# Altium project Shaeen.PrjPcb (part 1 of 2)
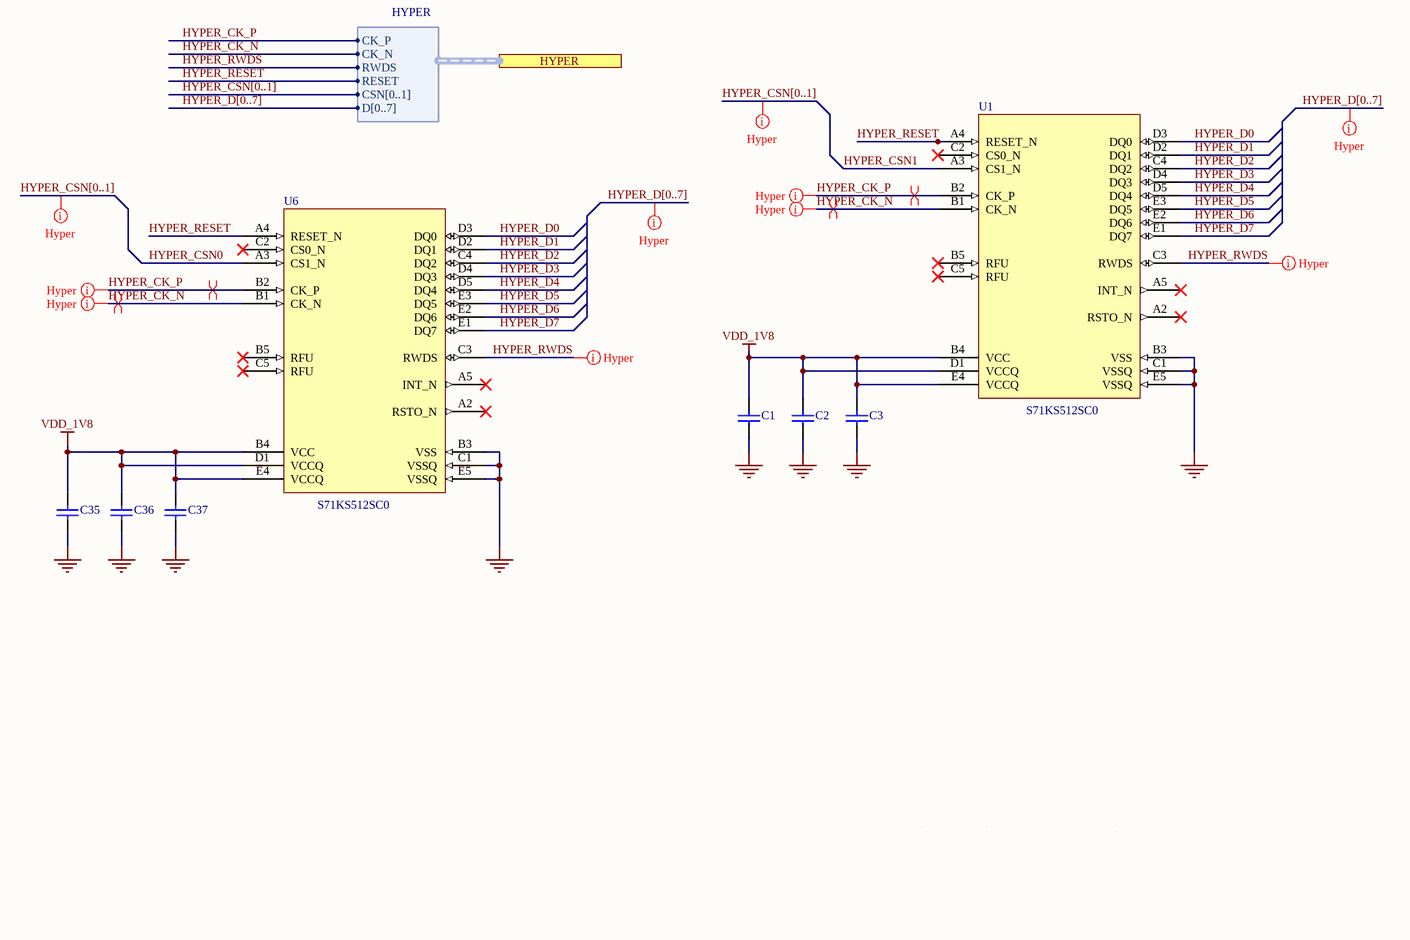
[diagram p0: HyperRAM.SchDoc]
6 sheets, 163 parts. Net scope: flat (ports and power ports of the same name join across sheets).
Board file: Shaheen.PcbDoc
Sheets:
  HyperRAM.SchDoc
  HyperRAM2.SchDoc
  Nordic.SchDoc
  PowerDomain.SchDoc
  Shaheen.SchDoc
  Switches.SchDoc

## Sheet HyperRAM.SchDoc: Shaheen PCB Board
size A3; Author: Mattia Sinigaglia; CompanyName: University of Bologna; DrawnBy: Mattia Sinigaglia; Organization: EES - Micrel Lab; Revision: v1; SheetNumber: 1; SheetTotal: 6

### Parts
C1  VJ0603Y104KNXAO  [CAPC1608X92X38LL15T08]  (value not drawn)
C2  VJ0603Y104KNXAO  [CAPC1608X92X38LL15T08]  (value not drawn)
C3  VJ0603Y104KNXAO  [CAPC1608X92X38LL15T08]  (value not drawn)
C35  VJ0603Y104KNXAO  [CAPC1608X92X38LL15T08]  (value not drawn)
C36  VJ0603Y104KNXAO  [CAPC1608X92X38LL15T08]  (value not drawn)
C37  VJ0603Y104KNXAO  [CAPC1608X92X38LL15T08]  (value not drawn)
U1  S71KS512SC0  [FBGA24_A-130]
U6  S71KS512SC0  [FBGA24_A-130]

### Ports
HYPER (harness HYPER)

### Harnesses
HYPER: CK_N, CK_P, RWDS, CSN[0..1], D[0..7], RESET

### Nets
GND: C1.1 C2.1 C3.1 C35.1 C36.1 C37.1 U1.B3(VSS) U1.C1(VSSQ) U1.E5(VSSQ) U6.B3(VSS) U6.C1(VSSQ) U6.E5(VSSQ)
VDD_1V8: C1.2 C2.2 C3.2 C35.2 C36.2 C37.2 U1.B4(VCC) U1.D1(VCCQ) U1.E4(VCCQ) U6.B4(VCC) U6.D1(VCCQ) U6.E4(VCCQ)
HYPER_CK_N: U1.B1(CK_N) U6.B1(CK_N) ; port HYPER.CK_N
HYPER_CK_P: U1.B2(CK_P) U6.B2(CK_P) ; port HYPER.CK_P
HYPER_CSN0: U6.A3(CS1_N)
HYPER_CSN1: U1.A3(CS1_N)
HYPER_D0: U1.D3(DQ0) U6.D3(DQ0)
HYPER_D1: U1.D2(DQ1) U6.D2(DQ1)
HYPER_D2: U1.C4(DQ2) U6.C4(DQ2)
HYPER_D3: U1.D4(DQ3) U6.D4(DQ3)
HYPER_D4: U1.D5(DQ4) U6.D5(DQ4)
HYPER_D5: U1.E3(DQ5) U6.E3(DQ5)
HYPER_D6: U1.E2(DQ6) U6.E2(DQ6)
HYPER_D7: U1.E1(DQ7) U6.E1(DQ7)
HYPER_RESET: U1.A4(RESET_N) U6.A4(RESET_N) ; port HYPER.RESET
HYPER_RWDS: U1.C3(RWDS) U6.C3(RWDS) ; port HYPER.RWDS

Not connected (* = marked no-connect by the designer): U1 A2(RSTO_N)* A5(INT_N)* B5(RFU)* C2(CS0_N)* C5(RFU)*; U6 A2(RSTO_N)* A5(INT_N)* B5(RFU)* C2(CS0_N)* C5(RFU)*

### Buses and harness runs
bus HYPER_CSN[0..1]
bus HYPER_D[0..7]

### Layout directives
net class Hyper: (no net found under the mark), HYPER_CK_N, HYPER_CK_P, HYPER_RWDS
differential pair: HYPER_CK_N, HYPER_CK_P

### Notes on the sheet
- 1
- 2
- 3
- 4
- 5
- 6
- 7
- 8
- A
- B
- C
- D
- Project:
- Date:
- Drawing number:
- Rev:
- Format:
- A3
- Drawn by:
- Laboratory:
- Page
- Sheet:
- of
- File:

### Library data of the parts
C1-C3 C35-C37 = CMP-1035-02588-2: Manufacturer: Vitramon; Part Number: VJ0603Y104KNXAO

## Sheet HyperRAM2.SchDoc: Shaheen PCB Board
size A3; Author: Mattia Sinigaglia; CompanyName: University of Bologna; DrawnBy: Mattia Sinigaglia; Organization: EES - Micrel Lab; Revision: v1; SheetNumber: 2; SheetTotal: 6
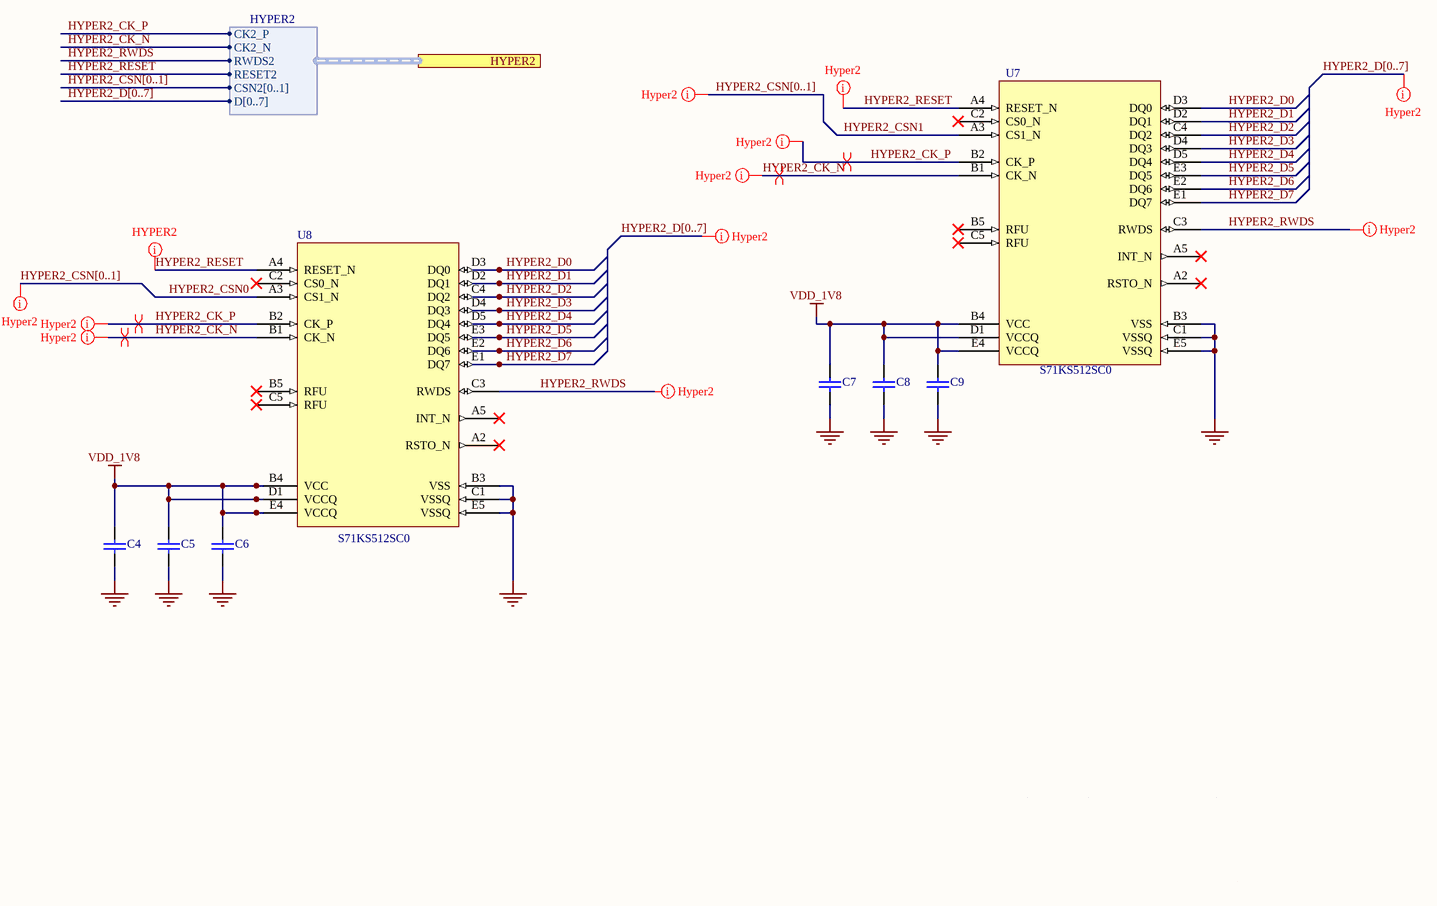
[diagram p1: HyperRAM2.SchDoc]

### Parts
C4  VJ0603Y104KNXAO  [CAPC1608X92X38LL15T08]  (value not drawn)
C5  VJ0603Y104KNXAO  [CAPC1608X92X38LL15T08]  (value not drawn)
C6  VJ0603Y104KNXAO  [CAPC1608X92X38LL15T08]  (value not drawn)
C7  VJ0603Y104KNXAO  [CAPC1608X92X38LL15T08]  (value not drawn)
C8  VJ0603Y104KNXAO  [CAPC1608X92X38LL15T08]  (value not drawn)
C9  VJ0603Y104KNXAO  [CAPC1608X92X38LL15T08]  (value not drawn)
U7  S71KS512SC0  [FBGA24_A-130]
U8  S71KS512SC0  [FBGA24_A-130]

### Ports
HYPER2 (harness HYPER2)

### Harnesses
HYPER2: D[0..7], CK2_P, CK2_N, RWDS2, CSN2[0..1], RESET2

### Nets
GND: C4.1 C5.1 C6.1 C7.1 C8.1 C9.1 U7.B3(VSS) U7.C1(VSSQ) U7.E5(VSSQ) U8.B3(VSS) U8.C1(VSSQ) U8.E5(VSSQ)
VDD_1V8: C4.2 C5.2 C6.2 C7.2 C8.2 C9.2 U7.B4(VCC) U7.D1(VCCQ) U7.E4(VCCQ) U8.B4(VCC) U8.D1(VCCQ) U8.E4(VCCQ)
HYPER2_CK_N: U7.B1(CK_N) U8.B1(CK_N) ; port HYPER2.CK2_N
HYPER2_CK_P: U7.B2(CK_P) U8.B2(CK_P) ; port HYPER2.CK2_P
HYPER2_CSN0: U8.A3(CS1_N)
HYPER2_CSN1: U7.A3(CS1_N)
HYPER2_D0: U7.D3(DQ0) U8.D3(DQ0)
HYPER2_D1: U7.D2(DQ1) U8.D2(DQ1)
HYPER2_D2: U7.C4(DQ2) U8.C4(DQ2)
HYPER2_D3: U7.D4(DQ3) U8.D4(DQ3)
HYPER2_D4: U7.D5(DQ4) U8.D5(DQ4)
HYPER2_D5: U7.E3(DQ5) U8.E3(DQ5)
HYPER2_D6: U7.E2(DQ6) U8.E2(DQ6)
HYPER2_D7: U7.E1(DQ7) U8.E1(DQ7)
HYPER2_RESET: U7.A4(RESET_N) U8.A4(RESET_N) ; port HYPER2.RESET2
HYPER2_RWDS: U7.C3(RWDS) U8.C3(RWDS) ; port HYPER2.RWDS2

Not connected (* = marked no-connect by the designer): U7 A2(RSTO_N)* A5(INT_N)* B5(RFU)* C2(CS0_N)* C5(RFU)*; U8 A2(RSTO_N)* A5(INT_N)* B5(RFU)* C2(CS0_N)* C5(RFU)*

### Buses and harness runs
bus HYPER2_CSN[0..1]
bus HYPER2_D[0..7]

### Layout directives
mark named HYPER2: HYPER2_RESET
net class Hyper2: (no net found under the mark), HYPER2_CK_N, HYPER2_CK_P, HYPER2_RESET, HYPER2_RWDS
differential pair: HYPER2_CK_N, HYPER2_CK_P

### Notes on the sheet
- 1
- 2
- 3
- 4
- 5
- 6
- 7
- 8
- A
- B
- C
- D
- Project:
- Date:
- Drawing number:
- Rev:
- Format:
- A3
- Drawn by:
- Laboratory:
- Page
- Sheet:
- of
- File:

### Library data of the parts
C4-C6 C8 C9 = CMP-1035-02588-2: Manufacturer: Vitramon; Part Number: VJ0603Y104KNXAO
C7 = CMP-1035-02588-2: 100nF; Manufacturer: Vitramon; Part Number: VJ0603Y104KNXAO

## Sheet Nordic.SchDoc: Shaheen PCB Board
size A3; Author: Mattia Sinigaglia; CompanyName: University of Bologna; DrawnBy: Mattia Sinigaglia; Organization: EES - Micrel Lab; Revision: v1; SheetNumber: 4; SheetTotal: 6
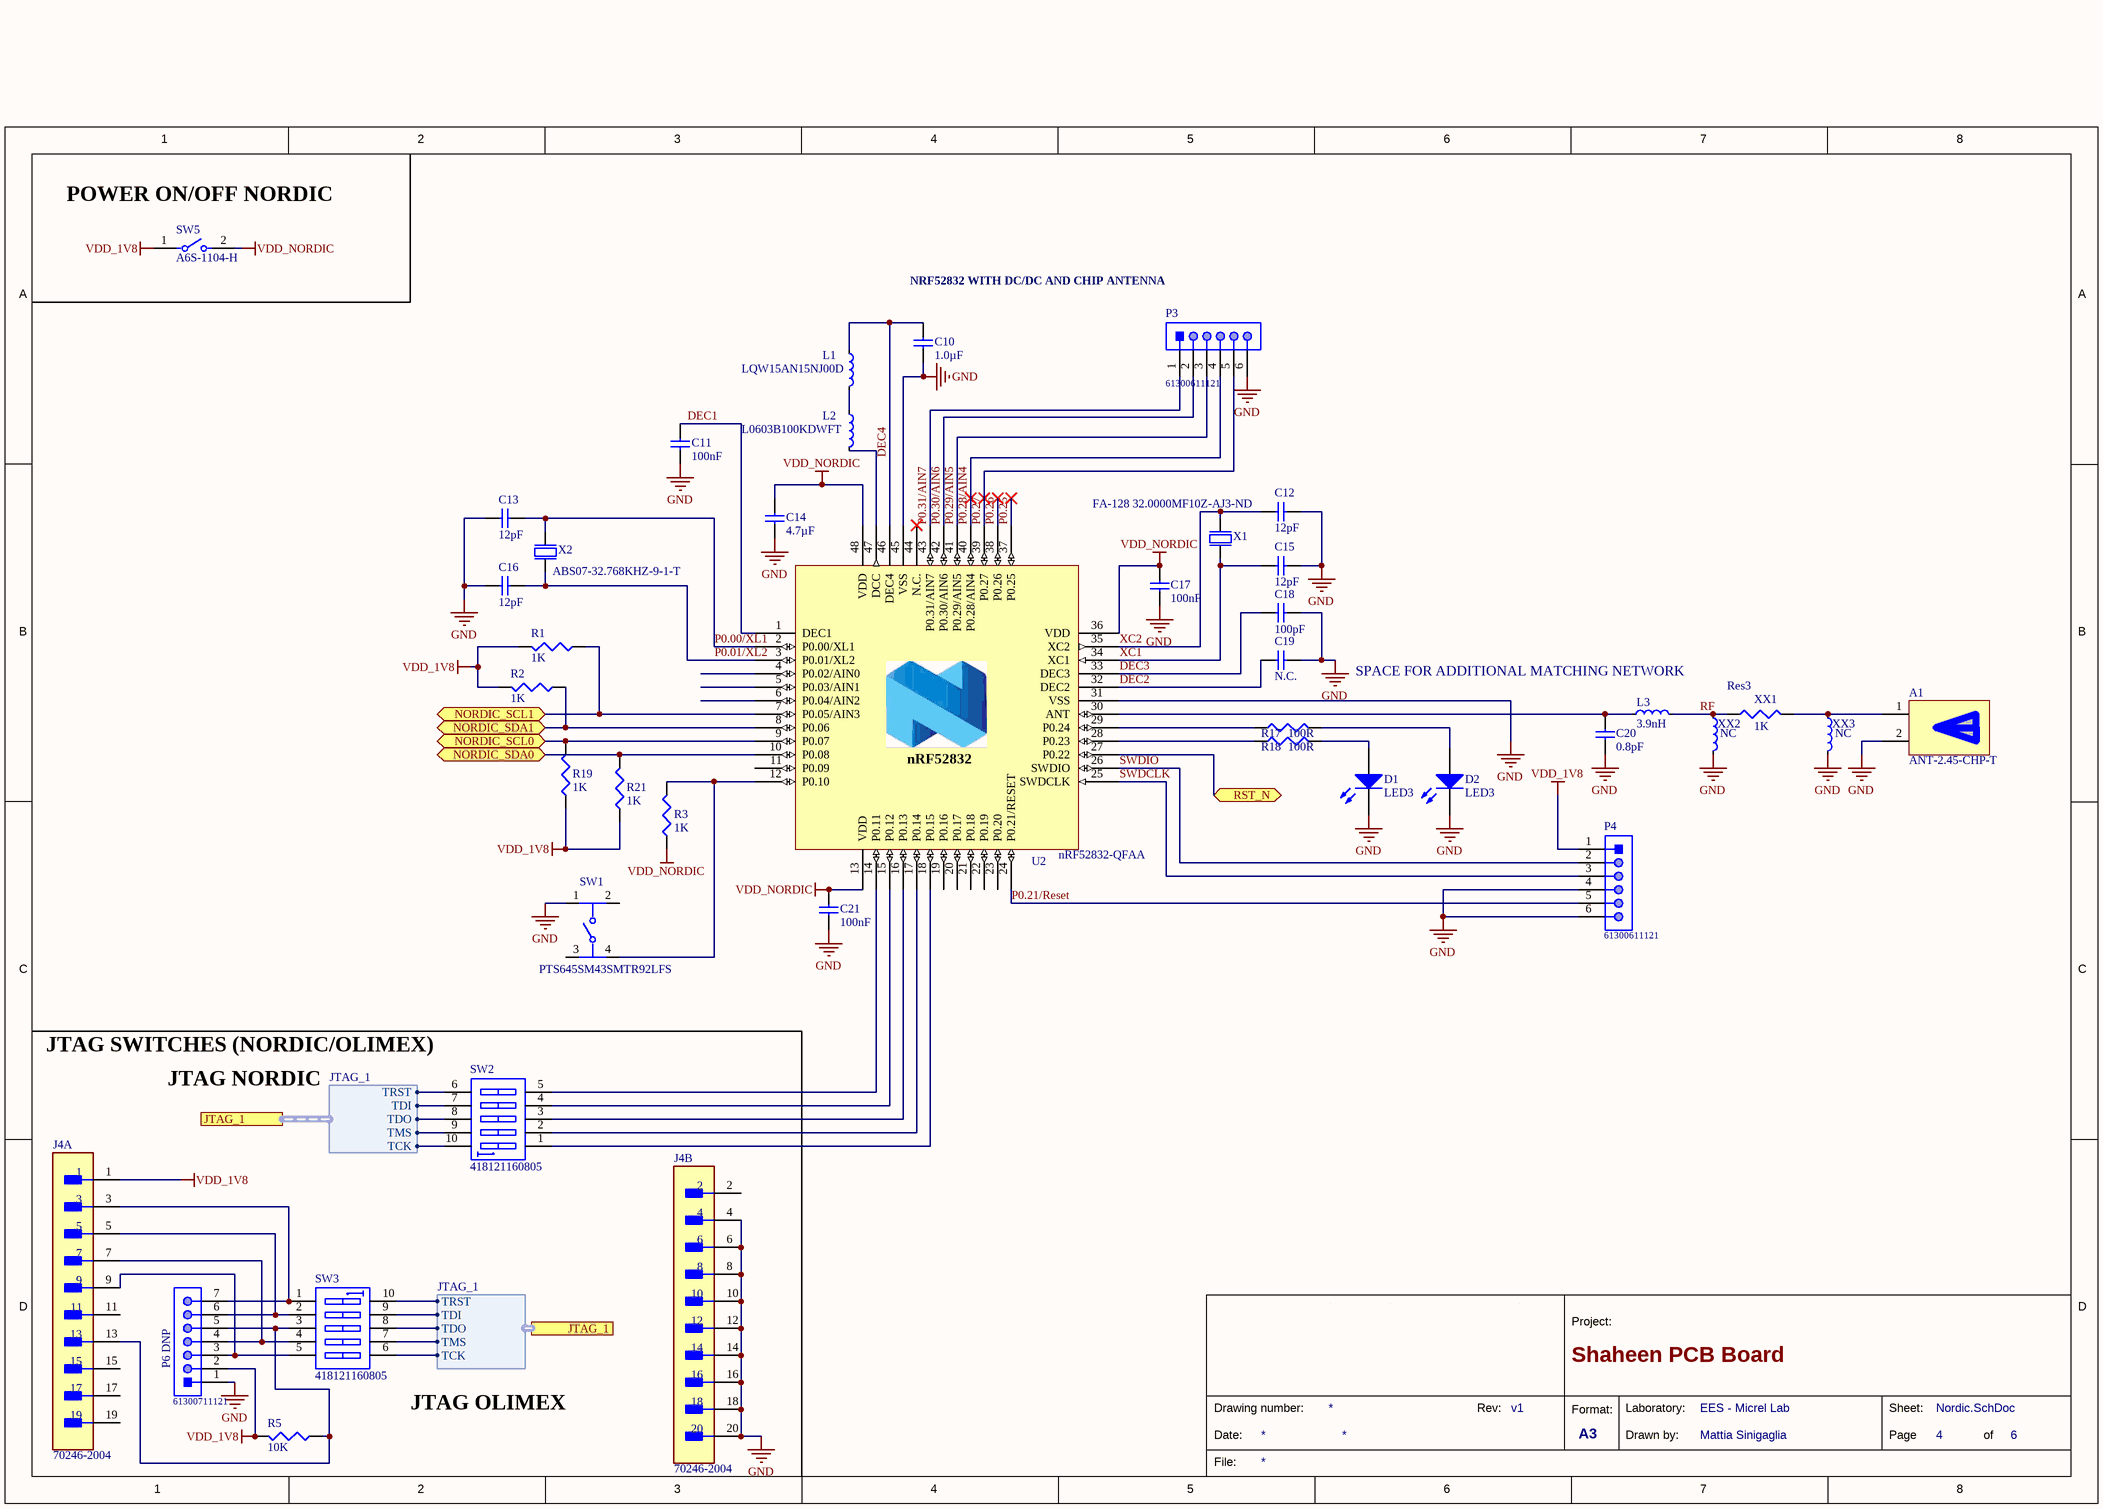
[diagram p2: Nordic.SchDoc]

### Parts
A1  ANT-2.45-CHP-T  [ANTENNACHIP]
C10  1.0µF  [CAPC1608X06L]
C11  100nF  [CAPC1005X04L]
C12  12pF  [CAPC1005X04L]
C13  12pF  [CAPC1005X04L]
C14  4.7µF  [CAPC1608X06L]
C15  12pF  [CAPC1005X04L]
C16  12pF  [CAPC1005X04L]
C17  100nF  [CAPC1005X04L]
C18  100pF  [CAPC1005X04L]
C19  N.C.  [CAPC1005X04L]
C20  0.8pF  [CAPC1005X04L]
C21  100nF  [CAPC1005X04L]
D1  LED3  [0603]
D2  LED3  [0603]
J4  70246-2004  [FP-70246-2004-MFG]  (parts A,B of 2)
L1  LQW15AN15NJ00D  [INDC1005X04L]
L2  L0603B100KDWFT  [J1-0603]
L3  3.9nH  [INDC1005X04L]
P3  61300611121  [61300611121]
P4  61300611121  [61300611121]
P6_DNP  61300711121  [61300711121]
R1  value 1K  [J1-0603]  (hidden comment: 0R)
R2  value 1K  [J1-0603]  (hidden comment: 0R)
R3  value 1K  [J1-0603]  (hidden comment: 0R)
R5  value 10K  [J1-0603]  (hidden comment: 0R)
R17  value 100R  [J1-0603]  (hidden comment: Res3)
R18  value 100R  [J1-0603]  (hidden comment: Res3)
R19  value 1K  [J1-0603]  (hidden comment: 0R)
R21  value 1K  [J1-0603]  (hidden comment: 0R)
SW1  PTS645SM43SMTR92LFS  [FP-PTS645SM43SMTR92LFS-MFG]
SW2  418121160805  [418121160805]
SW3  418121160805  [418121160805]
SW5  A6S-1104-H  [FP-A6S-1104-H-MFG]
U2  nRF52832-QFAA  [QFN40P600X600X90-48N]
X1  FA-128 32.0000MF10Z-AJ3-ND  [BT-XTAL_2016]
X2  ABS07-32.768KHZ-9-1-T  [ABS07-32.768KHZ-9-1-T]
XX1  Res3  value 1K  [J1-0603]
XX2  NC  [INDC1005X04L]
XX3  NC  [INDC1005X04L]

### Ports
JTAG_1 (harness JTAG_1), NORDIC_SCL0 (bidir), NORDIC_SCL1 (bidir), NORDIC_SDA0 (bidir), NORDIC_SDA1 (bidir), RST_N (bidir)

### Harnesses
JTAG_1: TRST, TDI, TDO, TMS, TCK

### Nets
GND: A1.2(NC) C10.1 C11.2 C12.2 C13.2 C14.2 C15.2 C16.2 C17.2 C18.2 C19.1 C20.1 C21.2 D1.2(K) D2.2(K) J4.4 J4.6 J4.8 J4.10 J4.12 J4.14 J4.16 J4.18 J4.20 P3.6 P4.4 P4.6 P6_DNP.1 SW1.1 U2.31(VSS) U2.45(VSS) U2.49(GND) X1.2(GND) X1.4(GND) XX2.2 XX3.2
VDD_1V8: J4.1 P4.1 P6_DNP.2 R1.1 R2.1 R5.1 R19.2 R21.2 SW5.1
VDD_NORDIC: C14.1 C17.1 C21.1 R3.2 SW5.2 U2.13(VDD) U2.36(VDD) U2.48(VDD)
DEC1: C11.1 U2.1(DEC1)
DEC2: C19.2 U2.32(DEC2)
DEC3: C18.1 U2.33(DEC3)
DEC4: C10.2 L1.1 U2.46(DEC4)
JTAG_TCK: SW2.10 SW3.6 ; port JTAG_1.TCK
JTAG_TDI: SW2.7 SW3.9 ; port JTAG_1.TDI
JTAG_TDO: SW2.8 SW3.8 ; port JTAG_1.TDO
JTAG_TMS: SW2.9 SW3.7 ; port JTAG_1.TMS
JTAG_TRST: SW2.6 SW3.10 ; port JTAG_1.TRST
P0.00/XL1: C13.1 U2.2(P0.00/XL1) X2.1(inp)
P0.01/XL2: C16.1 U2.3(P0.01/XL2) X2.2(out)
P0.21/Reset: P4.5 U2.24(P0.21/RESET)
P0.25: U2.37(P0.25)
P0.26: U2.38(P0.26)
P0.27: P3.5 U2.39(P0.27)
P0.28/AIN4: P3.4 U2.40(P0.28/AIN4)
P0.29/AIN5: P3.3 U2.41(P0.29/AIN5)
P0.30/AIN6: P3.2 U2.42(P0.30/AIN6)
P0.31/AIN7: P3.1 U2.43(P0.31/AIN7)
RF: L3.2 XX1.1 XX2.1
SWDCLK: P4.3 U2.25(SWDCLK)
SWDIO: P4.2 U2.26(SWDIO)
XC1: C15.1 U2.34(XC1) X1.1(inp)
XC2: C12.1 U2.35(XC2) X1.3(out)
NetA1_1: A1.1(IN) XX1.2 XX3.1
NetC20_2: C20.2 L3.1 U2.30(ANT)
NetD1_1: D1.1(A) R18.2
NetD2_1: D2.1(A) R17.2
NetIC1_6: U2.27(P0.22) ; port RST_N
NetIC2_D3: R2.2 U2.8(P0.06) ; port NORDIC_SDA1
NetIC2_E2: R1.2 U2.7(P0.05/AIN3) ; port NORDIC_SCL1
NetIC3_D3: R21.1 U2.10(P0.08) ; port NORDIC_SDA0
NetIC3_E2: R19.1 U2.9(P0.07) ; port NORDIC_SCL0
NetJ4_3: J4.3 P6_DNP.7 SW3.1
NetJ4_5: J4.5 P6_DNP.6 SW3.2
NetJ4_7: J4.7 P6_DNP.4 SW3.4
NetJ4_9: J4.9 P6_DNP.3 SW3.5
NetJ4_13: J4.13 P6_DNP.5 R5.2 SW3.3
NetL1_2: L1.2 L2.1
NetL2_2: L2.2 U2.47(DCC)
NetR3_1: R3.1 SW1.4 U2.12(P0.10)
NetR17_1: R17.1 U2.29(P0.24)
NetR18_1: R18.1 U2.28(P0.23)
NetSW2_1: SW2.1 U2.18(P0.15)
NetSW2_2: SW2.2 U2.17(P0.14)
NetSW2_3: SW2.3 U2.16(P0.13)
NetSW2_4: SW2.4 U2.15(P0.12)
NetSW2_5: SW2.5 U2.14(P0.11)

Not connected (* = marked no-connect by the designer): J4 2 11 15 17 19; SW1 2 3; U2 4(P0.02/AIN0) 5(P0.03/AIN1) 6(P0.04/AIN2) 11(P0.09) 19(P0.16) 20(P0.17) 21(P0.18) 22(P0.19) 23(P0.20) 44(N.C.)*

### Notes on the sheet
- (near SW5) POWER ON/OFF NORDIC
- NRF52832 WITH DC/DC AND CHIP ANTENNA
- SPACE FOR ADDITIONAL MATCHING NETWORK
- JTAG SWITCHES (NORDIC/OLIMEX)
- JTAG NORDIC
- JTAG OLIMEX
- 1
- 2
- 3
- 4
- 5
- 6
- 7
- 8
- A
- B
- C
- D
- Project:
- Date:
- Drawing number:
- Rev:
- Format:
- A3
- Drawn by:
- Laboratory:
- Page
- Sheet:
- of
- File:
- (in symbol nRF52832-QFAB) nRF52832

### Library data of the parts
A1 = Linx ANT-2.45-CHP-x: Amtenna; Manufacturer: Linx; Supplier PN: ANT-2.45-CHPCT-ND; Supplier: Digikey; Manufacturer PN: ANT-2.45-CHP-T
C10 = C0603-1µ0: Capacitor, X7R, ±10%; Note: 16V; Artikkelnr Noca: 20039335; Artikkelnr Simpro: N.A.; Part Number: C0603-1µ0; Manufacturer: *; Manufacturer Part Number: *; Datasheet: *; LatestRevisionDate: 2013-06-05; Pin Count: 2; Publisher: Nordic Semiconductor; Published: 2009-05-08; Value: 1.0µF; Supplier: *; Supplier part number: *; 2nd source Supplier: *; 2nd source part number: *; Footprint Doc: 0603
C11 C17 C21 = C0402-100n: Capacitor, X7R, ±10%; Note: 16V; Artikkelnr Noca: 20039200; Artikkelnr Simpro: N.A.; Part Number: C0402-100n; Manufacturer: *; Manufacturer Part Number: *; Datasheet: *; LatestRevisionDate: 2009-11-23; Pin Count: 2; Publisher: Nordic Semiconductor; Published: 2009-05-08; Value: 100nF; Supplier: *; Supplier part number: *; 2nd source Supplier: *; 2nd source part number: *; Footprint Doc: 0402
C12 C13 C15 C16 = C0402-12p: Capacitor, NP0, ±2%; Note: 50V; Artikkelnr Noca: 20029159; Artikkelnr Simpro: N.A.; Part Number: C0402-12p; Manufacturer: *; Manufacturer Part Number: *; Datasheet: *; LatestRevisionDate: 2011-05-11; Pin Count: 2; Publisher: Nordic Semiconductor; Published: 2009-05-08; Value: 12pF; Supplier: *; Supplier part number: *; 2nd source Supplier: *; 2nd source part number: *; Footprint Doc: 0402
C14 = C0603-4µ7: Capacitor, X5R, ±10%; Note: 6.3V; Artikkelnr Noca: 20069060; Artikkelnr Simpro: N.A.; Part Number: C0603-4µ7; Manufacturer: *; Manufacturer Part Number: *; Datasheet: *; LatestRevisionDate: 2009-11-23; Pin Count: 2; Publisher: Nordic Semiconductor; Published: 2009-05-08; Value: 4.7µF; Supplier: *; Supplier part number: *; 2nd source Supplier: *; 2nd source part number: *; Footprint Doc: 0603
C18 = C0402-100p: Capacitor, NP0, ±5%; Note: 50V; Artikkelnr Noca: 20029135; Artikkelnr Simpro: N.A.; Part Number: C0402-100p; Manufacturer: *; Manufacturer Part Number: *; Datasheet: *; LatestRevisionDate: 2009-05-08; Pin Count: 2; Publisher: Nordic Semiconductor; Published: 2009-05-08; Value: 100pF; Supplier: *; Supplier part number: *; 2nd source Supplier: *; 2nd source part number: *; Footprint Doc: 0402
C19 = C0402-N.C.: Not mounted; Note: Chip Cap; Artikkelnr Noca: N.A.; Part Number: C0402-N.C.; Manufacturer: *; Manufacturer Part Number: *; Datasheet: *; LatestRevisionDate: 2009-05-08; Pin Count: 2; Publisher: Nordic Semiconductor; Published: 2009-05-08; Value: N.C.; Supplier: *; Supplier part number: *; 2nd source Supplier: *; 2nd source part number: *; Footprint Doc: 0402; Artikkelnr Simpro: N.A.
C20 = C0402-0.8p: Capacitor, NP0, ±5%; Note: 50V; Artikkelnr Noca: 20029147; Artikkelnr Simpro: N.A.; Part Number: C0402-0.8p; Manufacturer: *; Manufacturer Part Number: *; Datasheet: *; LatestRevisionDate: 2012-11-21; Pin Count: 2; Publisher: Nordic Semiconductor; Published: 2009-05-08; Value: 0.8pF; Supplier: *; Supplier part number: *; 2nd source Supplier: *; 2nd source part number: *; Footprint Doc: 0402
D1 D2 = LED3: Typical BLUE SiC LED; Published: 8-Jun-2000; LatestRevisionDate: 17-Dec-2003; LatestRevisionNote: PCB Footprint replaced.; DatasheetVersion: 16-Apr-2002; PackageVersion: 16-Apr-2002; PackageReference: 3.5X2.8X1.9; Publisher: Altium Limited; PackageDescription: SM LED; 2 C-Bend Leads; Body 3.5 x 2.8 x 1.9 mm, inc leads (LxWxH typ)
J4 = CMP-04776-000337-1: CONN HEADER VERT 20POS 2.54MM; Voltage Rating (DC): 250V; Number of Contacts: 20; Current Rating: 2.5A; Glow Wire Compliant: Non-compliant; Gender: Male; Termination: Solder; Min Operating Temperature: -55°C; Voltage Rating: 250V; Series: 70246; Orientation: Vertical; Radiation Hardening: No; Contact Material: Gold; Number of Circuits: 20; Packaging: Tray; Flammability Rating: UL94 V-0; Contact Plating: Gold; Max Voltage Rating (DC): 250V; Package Quantity: 720; ELV: Compliant; Max Operating Temperature: 120°C; Number of Positions: 20; Number of Rows: 2; Pitch: 2.54mm; Mount: Through Hole
L1 = L0402-15n: High frequency chip inductor ±10%; Manufacturer: Taiyo Yuden; Manufacturer Part Number: HK100515NJ-T; 2nd source part number: 658-1328; Value: 15nH; Artikkelnr Noca: 33029323; Artikkelnr Simpro: N.A.; Part Number: L0402-15n; LatestRevisionDate: 2012-09-19; Pin Count: 2; Publisher: Nordic Semiconductor; Published: 2010-07-12; Note: High frequency chip inductor ±10%; Supplier: Digi-Key; Datasheet: http://www.yuden.co.jp/productdata/catalog/en/mlci04_e.pdf; Supplier part number: 587-1521-1-ND; 2nd source Supplier: Farnell; Footprint Doc: 0402
L2 = L0603-10µ: Chip inductor, IDC,min = 50 mA, ±20%; Manufacturer: Taiyo Yuden; Manufacturer Part Number: LBMF1608T100K; 2nd source part number: 178-6105; Value: 10µH; Note: LBMF1608T100K 10µH 80mA 0603; Artikkelnr Noca: 33029314; Artikkelnr Simpro: N.A.; Part Number: L0603-10µ; Datasheet: http://www.yuden.co.jp/ut/product/pdf/elb2_e.pdf; LatestRevisionDate: 2012-09-19; Pin Count: 2; Publisher: Nordic Semiconductor; Published: 2010-02-24; Supplier: Digi-Key; Supplier part number: 587-1714-1-ND; 2nd source Supplier: Farnell; Footprint Doc: 0603
L3 = L0402-3n9: High frequency chip inductor ±5%; Manufacturer: Murata; Manufacturer Part Number: LQP15MN3N9B02D; Artikkelnr Noca: 33029151; Artikkelnr Simpro: N.A.; Part Number: L0402-3n9; Datasheet: http://search.murata.co.jp/Ceramy/image/img/PDF/ENG/L0075S0084LQP15M.pdf; LatestRevisionDate: 2012-09-19; Pin Count: 2; Publisher: Nordic Semiconductor; Published: 2009-05-08; Value: 3.9nH; Note: High frequency chip inductor ±5%; Supplier: Digi-Key; Supplier part number: 490-1131-1-ND; 2nd source Supplier: *; 2nd source part number: *; Footprint Doc: 0402
P3 P4 = CMP-1502-01070-1: THT Vertical Pin Header WR-PHD, Pitch 2.54 mm, Single Row, 6 pins; Manufacturer: Wurth Elektronik; Gender: Male; Pin Number: 6; Pitch: 2.54mm; Working Voltage: 250VAC; Rated Current: 3A; Withstanding Voltage: 500VAC; Contact Resistance: 20mOhm; Operating Temperature: -40to105degC; Packaging: Bag; Datasheet URL: https://katalog.we-online.de/em/datasheet/6130xx11121.pdf; Package Reference: 61300611121; Mounting Technology: THT; Publisher: WurthElektronik; Part Number: 61300611121; Manufacturer URL: http://www.we-online.de; Row Number: Single; Orientation: Vertical
P6_DNP = CMP-1502-01074-1: THT Vertical Pin Header WR-PHD, Pitch 2.54 mm, Single Row, 7 pins; Manufacturer: Wurth Elektronik; Pin Number: 7; Gender: Male; Working Voltage: 250VAC; Contact Resistance: 20mOhm; Rated Current: 3A; Pitch: 2.54mm; Withstanding Voltage: 500VAC; Row Number: Single; Packaging: Bag; Orientation: Vertical; Manufacturer URL: http://www.we-online.de; Datasheet URL: https://katalog.we-online.de/em/datasheet/6130xx11121.pdf; Part Number: 61300711121; Publisher: WurthElektronik; Operating Temperature: -40to105degC; Mounting Technology: THT; Package Reference: 61300711121
R1-R3 R5 R17-R19 R21 XX1 = Res3: Resistor; Published: 8-Jun-2000; LatestRevisionDate: 29-May-2009; LatestRevisionNote: IPC-7351 Footprint Added.; PackageReference: J1-0603; Publisher: Altium Limited; PackageDescription: Chip Resistor
SW1 = CMP-2000-05160-2: SWITCH TACTILE SPST-NO 0.05A 12V; Contact Resistance: 100mR; Throw Configuration: SPST; Illumination Type: Non-Illuminated; Mechanical Life: 100000Cycles; Current Rating: 50mA; Switch Function: Off-Mom; Actuator Length: 0.85mm; Actuator Material: Nylon; Actuator Type: Standard; Operating Force: 160gf; Min Operating Temperature: -20°C; REACH SVHC: No SVHC; Termination: Gull Wing; Case/Package: SMD/SMT; Packaging: Tape and Reel; Mount: Surface Mount; Voltage Rating (DC): 12V; Orientation: Straight; Lead Free: Lead Free; Contact Material: Silver; Color: Black; Max Current Rating: 50mA; Contact Plating: Silver; Depth: 9mm; Package Quantity: 1; Max Voltage Rating (DC): 12V; Length: 6mm; Max Operating Temperature: 60°C
SW2 SW3 = CMP-1437-00005-1: WS-DISV 2.54 mm small compact SMD Dip Switch with top tape; Manufacturer: Wuerth Elektronik; NoPins: 10; ComponentLink1Description: Manufacturer URL; ComponentLink1URL: http://www.we-online.com; ComponentLink2Description: Datasheet; ComponentLink2URL: http://katalog.we-online.de/em/datasheet/4181211608xx.pdf; PackageReference: 418121160805; PartNumber: 418121160805
SW5 = CMP-08827-000005-1: SWITCH SLIDE DIP SPST 25MA 24V; Manufacturer: Omron Electronics Inc-EMC Div; Throw Configuration: SPST-NO; Standoff Height: 0mm; Number Of Circuits: 1; Electromechanical Life: 1000Cycles; Contact Resistance: 200mΩ; Digikey Description: SWITCH SLIDE DIP SPST 25MA 24V; ComponentLink2Description: Datasheet; Mount: Surface Mount; Manufacturer Part Number: A6S-1104-H; ComponentLink2URL: https://omronfs.omron.com/en_US/ecb/products/pdf/en-a6s.pdf; Category: Switch; Height: 3.95mm; Device Class L3: DIP Switches; Octopart: https://octopart.com/a6s-1104-h-omron-55410938; Mouser Description: DIP Switches / SIP Switches Dip Switch; Lead Free: Yes; Temperature Range Low: -20°C; Temperature Range High: +70°C; Automotive: No; Ambient Temperature Range Low: -20°C; Ambient Temperature Range High: +70°C; Voltage Rating Dc: 24V; Device Class L2: Switches; RoHS: TRUE; Package: 0; Contact Current Rating: 25mA; Device Class L1: Electromechanical; Temperature: -20°C to +70°C
U2 = nRF52832-QFAB: Multi-protocol Bluetooth Low Energy, ANT and 2.4GHz proprietary system-on-chip; Manufacturer: Nordic Semiconductor; Artikkelnr Noca: N.A.; Part Number: nRF52832-QFAA; Manufacturer Part Number: nRF52832-QFAA; Datasheet: *; LatestRevisionDate: 2016-11-24; Pin Count: 48; Publisher: Nordic Semiconductor; Published: 2016-11-24; Value: nRF52832-QFAA; Note: *; Supplier: Nordic Semiconductor; Supplier part number: *; 2nd source Supplier: *; 2nd source part number: *; Footprint Doc: QFN-48; Artikkelnr Simpro: N.A.
X1 = XTAL_SMD2016_32MHz_8pF_General: XTAL SMD 2016, 32MHz, Cl=8pF, Total Tol: ±40ppm; Note: XTAL SMD 32.000MHz; Artikkelnr Noca: N.A.; Part Number: XTAL_SMD2016_32MHz_8pF_General; Manufacturer: *; Manufacturer Part Number: *; Datasheet: *; LatestRevisionDate: 2016-08-19; Pin Count: 4; Publisher: Nordic Semiconductor; Published: 2016-08-19; Value: 32MHz; Supplier: *; Supplier part number: *; 2nd source Supplier: *; 2nd source part number: *; Footprint Doc: XTAL_2016; Artikkelnr Simpro: N.A.
X2 = XTAL_SMD3215_32.768kHz_9pF_General: XTAL SMD 3215, 32.768kHz, Cl=9pF, Total Tol: ±50ppm; Note: XTAL SMD 32.768kHz; Artikkelnr Noca: N.A.; Part Number: XTAL_SMD3215_32.768kHz_9pF_General; Manufacturer: *; Manufacturer Part Number: *; Datasheet: *; LatestRevisionDate: 2016-08-19; Pin Count: 2; Publisher: Nordic Semiconductor; Published: 2016-08-19; Value: 32.768kHz; Supplier: *; Supplier part number: *; 2nd source Supplier: *; 2nd source part number: *; Footprint Doc: XTAL_3215; Artikkelnr Simpro: N.A.
XX2 XX3 = L0402-N.C.: Not mounted; Value: N.C.; Artikkelnr Noca: N.A.; Assembly: Not mounted; Part Number: L0402-N.C.; Manufacturer: *; Manufacturer Part Number: *; Datasheet: *; LatestRevisionDate: 2016-11-24; Pin Count: 2; Publisher: Nordic Semiconductor; Published: 2016-11-24; Note: *; Supplier: *; Supplier part number: *; 2nd source Supplier: *; 2nd source part number: *; Footprint Doc: 0402; Artikkelnr Simpro: N.A.; ComponentLink1Description: Datasheet; ComponentLink2Description: Supplier link

## Sheet PowerDomain.SchDoc: Shaheen PCB Board
size A3; Author: Mattia Sinigaglia; CompanyName: University of Bologna; DrawnBy: Mattia Sinigaglia; Organization: EES - Micrel Lab; Revision: v1; SheetNumber: 3; SheetTotal: 6
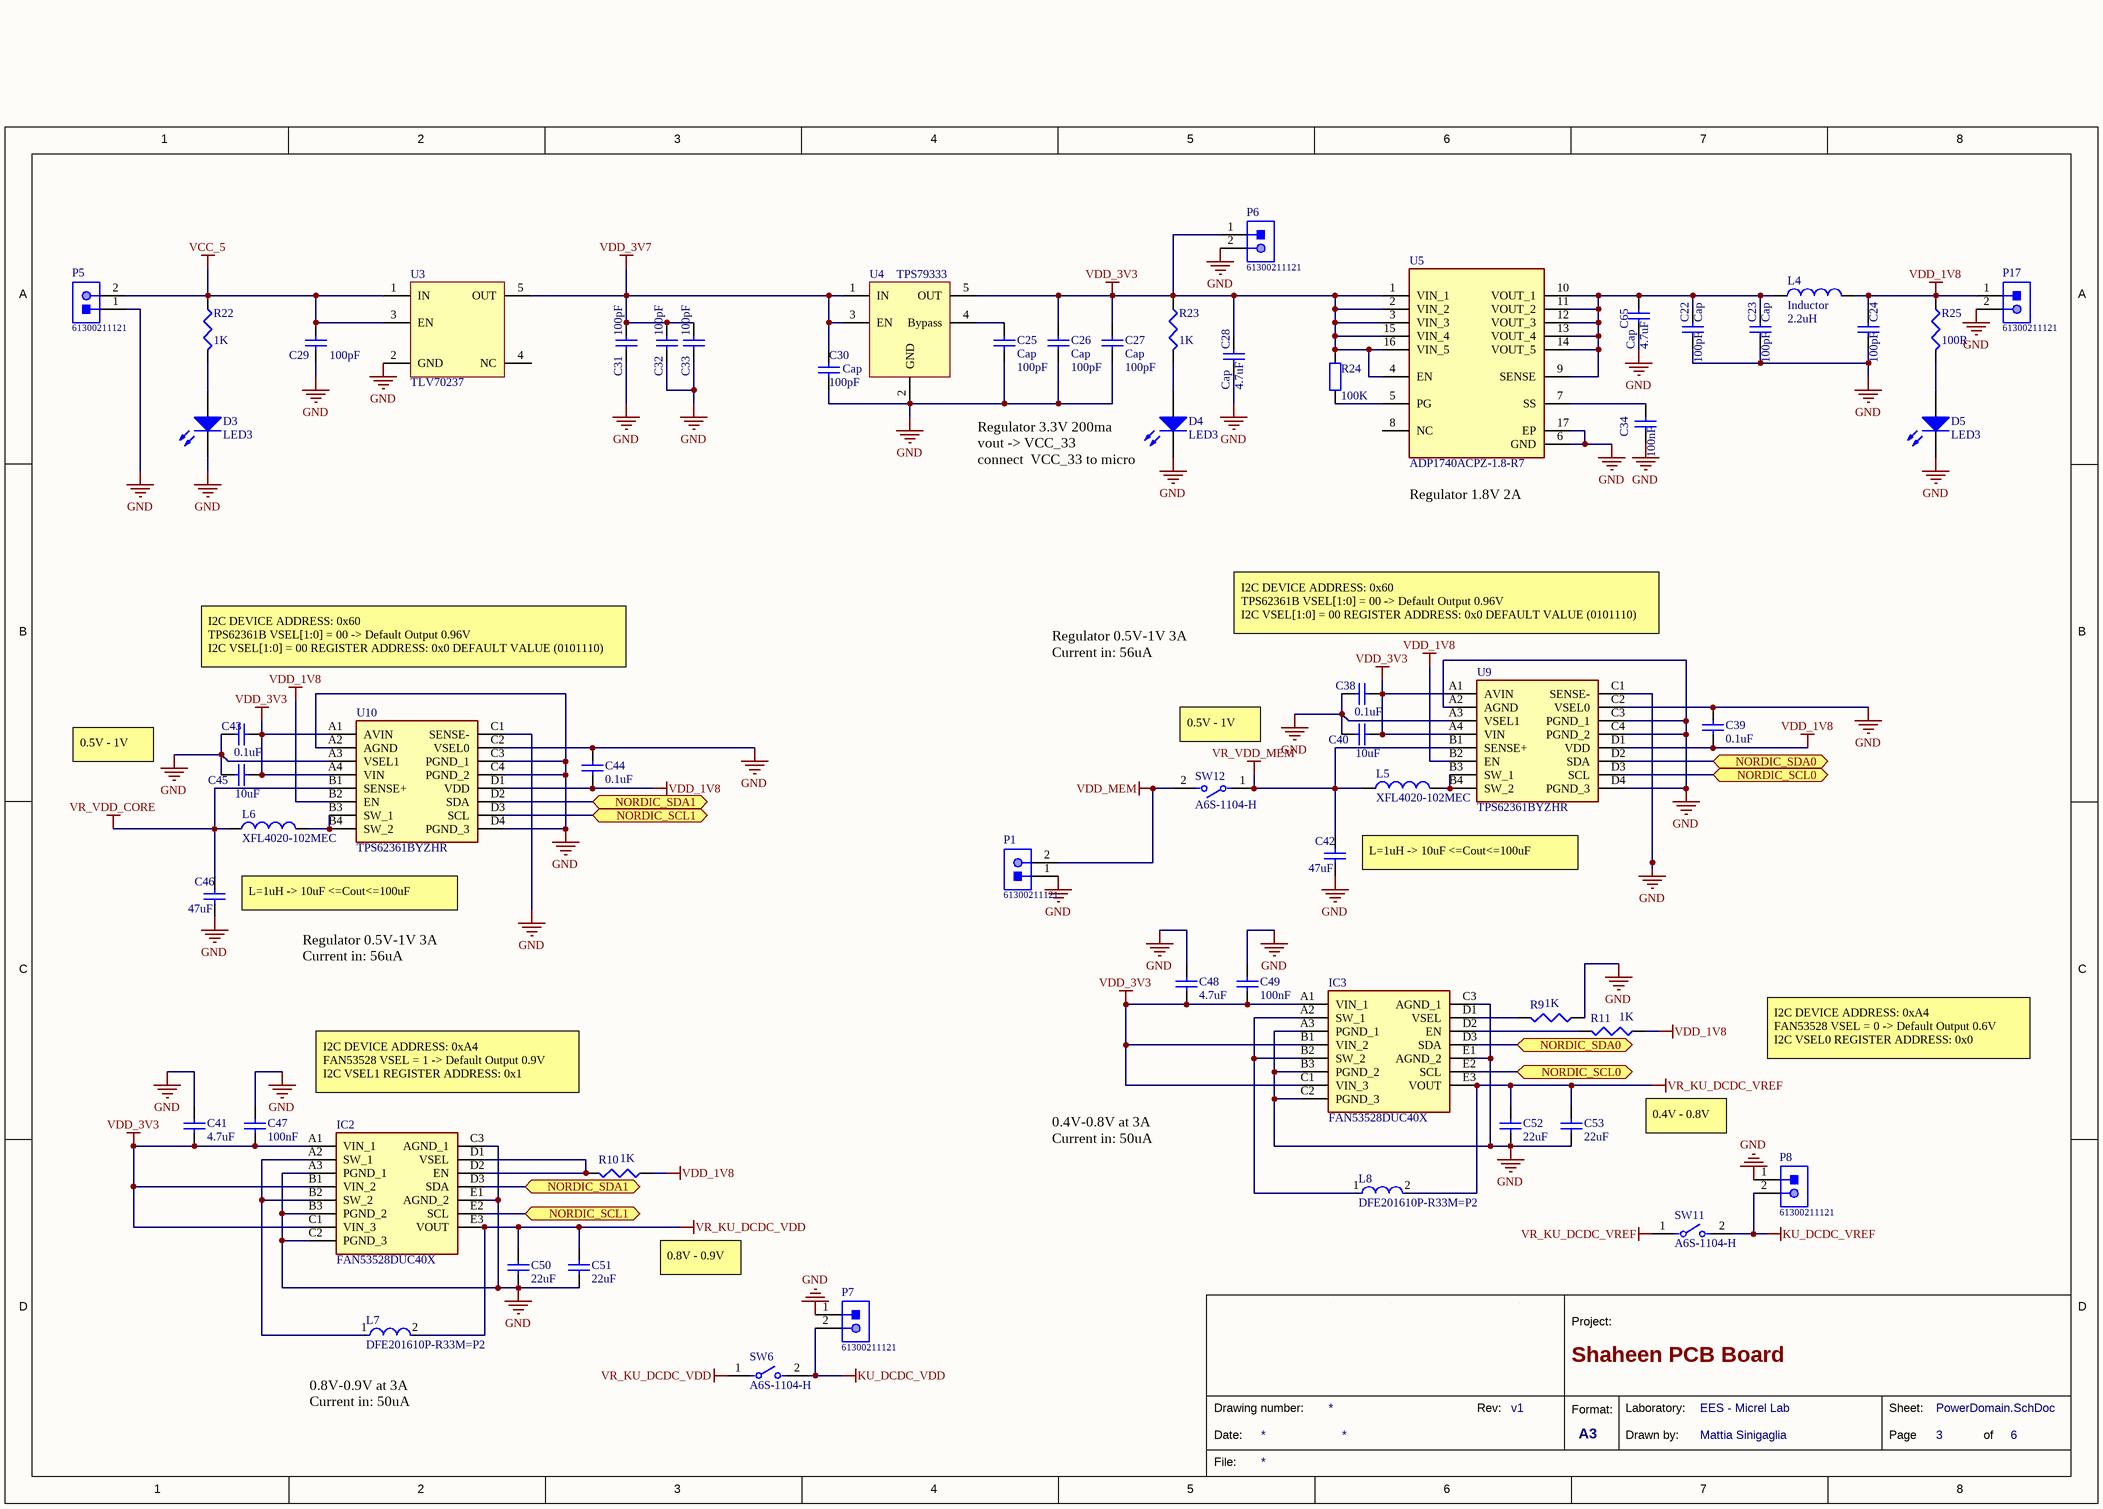
[diagram p3: PowerDomain.SchDoc]

### Parts
C22  Cap  value 100pF  [0603]
C23  Cap  value 100pF  [0603]
C24  value 100pF  [0603]  (hidden comment: Cap)
C25  Cap  value 100pF  [cap_0402_R - modified]
C26  Cap  value 100pF  [cap_0402_R - modified]
C27  Cap  value 100pF  [cap_0402_R - modified]
C28  Cap  value 4.7uF  [0603]
C29  value 100pF  [1608[0603]]  (hidden comment: Cap Semi)
C30  Cap  value 100pF  [cap_0402_R - modified]
C31  value 100pF  [1608[0603]]  (hidden comment: Cap Semi)
C32  value 100pF  [1608[0603]]  (hidden comment: Cap Semi)
C33  value 100pF  [1608[0603]]  (hidden comment: Cap Semi)
C34  value 100nF  [0603]
C38  value 0.1uF  [0603]  (hidden comment: Cap)
C39  value 0.1uF  [0603]  (hidden comment: Cap)
C40  value 10uF  [0603]  (hidden comment: Cap)
C41  value 4.7uF  [0603]  (hidden comment: Cap)
C42  value 47uF  [0603]  (hidden comment: Cap)
C43  value 0.1uF  [0603]  (hidden comment: Cap)
C44  value 0.1uF  [0603]  (hidden comment: Cap)
C45  value 10uF  [0603]  (hidden comment: Cap)
C46  value 47uF  [0603]  (hidden comment: Cap)
C47  value 100nF  [0603]  (hidden comment: Cap)
C48  value 4.7uF  [0603]  (hidden comment: Cap)
C49  value 100nF  [0603]  (hidden comment: Cap)
C50  value 22uF  [0603]  (hidden comment: Cap)
C51  value 22uF  [0603]  (hidden comment: Cap)
C52  value 22uF  [0603]  (hidden comment: Cap)
C53  value 22uF  [0603]  (hidden comment: Cap)
C65  Cap  value 4.7uF  [0603]
D3  LED3  [0603]
D4  LED3  [0603]
D5  LED3  [0603]
IC2  FAN53528DUC40X  [BGA15C40P3X5_131X202X62]
IC3  FAN53528DUC40X  [BGA15C40P3X5_131X202X62]
L4  Inductor  value 2.2uH  [0603]
L5  XFL4020-102MEC  [COIL-XFL4020_V]
L6  XFL4020-102MEC  [COIL-XFL4020_V]
L7  DFE201610P-R33M=P2  [FP-DFE201610C-MFG]
L8  DFE201610P-R33M=P2  [FP-DFE201610C-MFG]
P1  61300211121  [61300211121]
P5  61300211121  [61300211121]
P6  61300211121  [61300211121]
P7  61300211121  [61300211121]
P8  61300211121  [61300211121]
P17  61300211121  [61300211121]
R9  value 1K  [J1-0603]  (hidden comment: 0R)
R10  value 1K  [J1-0603]  (hidden comment: 0R)
R11  value 1K  [J1-0603]  (hidden comment: 0R)
R22  value 1K  [res_0402_R - modified]  (hidden comment: Res3)
R23  value 1K  [res_0402_R - modified]  (hidden comment: Res3)
R24  value 100K  [0603]
R25  value 100R  [res_0402_R - modified]  (hidden comment: Res3)
SW6  A6S-1104-H  [FP-A6S-1104-H-MFG]
SW11  A6S-1104-H  [FP-A6S-1104-H-MFG]
SW12  A6S-1104-H  [FP-A6S-1104-H-MFG]
U3  TLV70237  [SOT23__DDC__(R - PDSO-  G5)]
U4  TPS79333  [SOT_23__DBV_(R - PDSO - G5)]
U5  ADP1740ACPZ-1.8-R7  [ADP1740ACPZ-1.8-R7]
U9  TPS62361BYZHR  [BGA16C50P4X4_206X206X62]
U10  TPS62361BYZHR  [BGA16C50P4X4_206X206X62]

### Ports
NORDIC_SCL0 (bidir), NORDIC_SCL1 (bidir), NORDIC_SDA0 (bidir), NORDIC_SDA1 (bidir)

### Nets
GND: C22.2 C23.2 C24.2 C25.1 C26.2 C27.1 C28.2 C29.1 C30.1 C31.1 C32.1 C33.1 C34.2 C38.1 C39.1 C40.2 C41.1 C42.2 C43.1 C44.1 C45.2 C46.2 C47.1 C48.1 C49.1 C50.2 C51.2 C52.2 C53.2 C65.2 D3.2(K) D4.2(K) D5.2(K) IC2.A3(PGND_1) IC2.B3(PGND_2) IC2.C2(PGND_3) IC2.C3(AGND_1) IC2.E1(AGND_2) IC3.A3(PGND_1) IC3.B3(PGND_2) IC3.C2(PGND_3) IC3.C3(AGND_1) IC3.E1(AGND_2) P1.1 P5.1 P6.2 P7.1 P8.1 P17.2 R9.2 U3.2(GND) U4.2(GND) U5.6(GND) U5.17(EP) U9.A2(AGND) U9.A3(VSEL1) U9.C1(SENSE-) U9.C2(VSEL0) U9.C3(PGND_1) U9.C4(PGND_2) U9.D4(PGND_3) U10.A2(AGND) U10.A3(VSEL1) U10.C1(SENSE-) U10.C2(VSEL0) U10.C3(PGND_1) U10.C4(PGND_2) U10.D4(PGND_3)
KU_DCDC_VDD: P7.2 SW6.2
KU_DCDC_VREF: P8.2 SW11.2
VCC_5: C29.2 P5.2 R22.1 U3.1(IN) U3.3(EN)
VDD_1V8: C24.1 C39.2 C44.2 L4.2 P17.1 R10.2 R11.2 R25.1 U9.B2(EN) U9.D1(VDD) U10.B2(EN) U10.D1(VDD)
VDD_3V3: C26.1 C27.2 C28.1 C38.2 C40.1 C41.2 C43.2 C45.1 C47.2 C48.2 C49.2 IC2.A1(VIN_1) IC2.B1(VIN_2) IC2.C1(VIN_3) IC3.A1(VIN_1) IC3.B1(VIN_2) IC3.C1(VIN_3) P6.1 R23.1 R24.2 U4.5(OUT) U5.1(VIN_1) U5.2(VIN_2) U5.3(VIN_3) U5.4(EN) U5.15(VIN_4) U5.16(VIN_5) U9.A1(AVIN) U9.A4(VIN) U10.A1(AVIN) U10.A4(VIN)
VDD_3V7: C30.2 C31.2 C32.2 C33.2 U3.5(OUT) U4.1(IN) U4.3(EN)
VDD_MEM: P1.2 SW12.2
VR_KU_DCDC_VDD: C50.1 C51.1 IC2.E3(VOUT) L7.2 SW6.1
VR_KU_DCDC_VREF: C52.1 C53.1 IC3.E3(VOUT) L8.2 SW11.1
VR_VDD_CORE: C46.1 L6.1 U10.B1(SENSE+)
VR_VDD_MEM: C42.1 L5.1 SW12.1 U9.B1(SENSE+)
NetC22_1: C22.1 C23.1 C65.1 L4.1 U5.9(SENSE) U5.10(VOUT_1) U5.11(VOUT_2) U5.12(VOUT_3) U5.13(VOUT_4) U5.14(VOUT_5)
NetC25_2: C25.2 U4.4(Bypass)
NetC34_1: C34.1 U5.7(SS)
NetD3_1: D3.1(A) R22.2
NetD4_1: D4.1(A) R23.2
NetD5_1: D5.1(A) R25.2
NetIC2_A2: IC2.A2(SW_1) IC2.B2(SW_2) L7.1
NetIC2_D1: IC2.D1(VSEL) IC2.D2(EN) R10.1
NetIC2_D3: IC2.D3(SDA) U10.D2(SDA) ; port NORDIC_SDA1
NetIC2_E2: IC2.E2(SCL) U10.D3(SCL) ; port NORDIC_SCL1
NetIC3_A2: IC3.A2(SW_1) IC3.B2(SW_2) L8.1
NetIC3_D1: IC3.D1(VSEL) R9.1
NetIC3_D2: IC3.D2(EN) R11.1
NetIC3_D3: IC3.D3(SDA) U9.D2(SDA) ; port NORDIC_SDA0
NetIC3_E2: IC3.E2(SCL) U9.D3(SCL) ; port NORDIC_SCL0
NetL5_2: L5.2 U9.B3(SW_1) U9.B4(SW_2)
NetL6_2: L6.2 U10.B3(SW_1) U10.B4(SW_2)
NetR24_1: R24.1 U5.5(PG)

Not connected (* = marked no-connect by the designer): U3 4(NC); U5 8(NC)

### Notes on the sheet
- Regulator 3.3V 200ma
  vout -> VCC_33
  connect  VCC_33 to micro
- (near U5) Regulator 1.8V 2A
- I2C DEVICE ADDRESS: 0x60
  TPS62361B VSEL[1:0] = 00 -> Default Output 0.96V
  I2C VSEL[1:0] = 00 REGISTER ADDRESS: 0x0 DEFAULT VALUE (0101110)
- Regulator 0.5V-1V 3A
  Current in: 56uA
- 0.5V - 1V
- (near SW12) 0.5V - 1V
- (near C46) L=1uH -> 10uF <=Cout<=100uF
- (near C42) L=1uH -> 10uF <=Cout<=100uF
- I2C DEVICE ADDRESS: 0xA4
  FAN53528 VSEL = 0 -> Default Output 0.6V
  I2C VSEL0 REGISTER ADDRESS: 0x0
- I2C DEVICE ADDRESS: 0xA4
  FAN53528 VSEL = 1 -> Default Output 0.9V
  I2C VSEL1 REGISTER ADDRESS: 0x1
- 0.4V - 0.8V
- 0.4V-0.8V at 3A
  Current in: 50uA
- 0.8V - 0.9V
- (near L7) 0.8V-0.9V at 3A
  Current in: 50uA
- 1
- 2
- 3
- 4
- 5
- 6
- 7
- 8
- A
- B
- C
- D
- Project:
- Date:
- Drawing number:
- Rev:
- Format:
- A3
- Drawn by:
- Laboratory:
- Page
- Sheet:
- of
- File:

### Library data of the parts
C22-C28 C30 C34 C38-C53 C65 = Cap: Capacitor; Published: 8-Jun-2000; LatestRevisionDate: 17-Jul-2002; LatestRevisionNote: Re-released for DXP Platform.; PackageReference: RAD-0.3; Publisher: Altium Limited; PackageDescription: Radial Cap, Thru-Hole; 2 Leads; 0.3 in Pin Spacing
C29 C31-C33 = Cap Semi: Capacitor (Semiconductor SIM Model); Published: 8-Jun-2000; LatestRevisionDate: 29-May-2009; LatestRevisionNote: IPC-7351 Footprint Added.; PackageReference: C1206; Publisher: Altium Limited; PackageDescription: Chip Capacitor
D3-D5 = LED3: Typical BLUE SiC LED; Published: 8-Jun-2000; LatestRevisionDate: 17-Dec-2003; LatestRevisionNote: PCB Footprint replaced.; DatasheetVersion: 16-Apr-2002; PackageVersion: 16-Apr-2002; PackageReference: 3.5X2.8X1.9; Publisher: Altium Limited; PackageDescription: SM LED; 2 C-Bend Leads; Body 3.5 x 2.8 x 1.9 mm, inc leads (LxWxH typ)
IC2 IC3 = FAN53528DUC40X: Integrated Circuit; Manufacturer_Name: onsemi; Datasheet Link: https://www.onsemi.com/pub/Collateral/FAN53528-D.PDF; Height: 0.625mm; Manufacturer_Part_Number: FAN53528DUC40X
L4 = Inductor: Code_IEC: 1005; Published: 8-Jun-2000; LatestRevisionDate: 29-May-2009; LatestRevisionNote: IPC-7351 Footprint Added.; PackageReference: 0402-A; Publisher: Altium Limited; PackageDescription: Chip Inductor; Code_JEITA: 0402
L5 L6 = CMP-2000-07423-1: Shielded Power Inductor, 1 uH, 64 MHz, -40 to 125 degC, 2-Pin SMD, RoHS, Tape and Reel; Manufacturer: Coilcraft; Case Width: 4.3mm; Case Height: 2.1mm; Maximum DC Current: 11A; Core Material: Composite; Test Frequency: 100kHz; Tolerance: 20%; Maximum DC Resistance: 11.9mOhms; Inductance: 1uH; Self Resonant Frequency: 64MHz; RoHS: Details; Series: XFL4020; Case Length: 4.3mm; Package Reference: XFL4020; Dimensions: 4.3mmWx4.3mmLx2.1mmH; Product: PowerInductors; Datasheet Version: 07/2012; Manufacturer URL: http://www.coilcraft.com/; Termination Style: SMD/SMT; Mounting Technology: SurfaceMount; Operating Temperature Range: -40Cto+125C; Package Description: 2-Pin Surface Mount Device, Body 4 x 4 mm, Pitch 2.37 mm; Shielding: Shielded; Packaging: Reel; Datasheet URL: http://www.mouser.com/ds/2/597/xfl4020-270756.pdf
L7 L8 = CMP-06042-003298-1: Shielded Wirewound Inductor 0.33uH 20% 3500mA 0.034Ω 0806 (2016); Current Rating: 4.7A; DC Resistance (DCR): 34mR; Max DC Current: 3.5A; Test Frequency: 1MHz; Inductance: 330nH; Core Material: Ferrite; Case Code (Imperial): 0806; Case Code (Metric): 2016; Width: 0.063inch; Packaging: Tape and Reel; Mount: Surface Mount; Min Operating Temperature: -40°C; Length: 0.079inch; Case/Package: 0806; Height - Seated (Max): 0.039inch; Max Operating Temperature: 125°C; Shielding: Shielded; Tolerance: 20%; Depth: 1.6mm; Resistor Type: Wirewound
P1 P5-P8 P17 = CMP-1712-00002-4: THT Vertical Pin Header WR-PHD, Pitch 2.54 mm, Single Row, 2 pins; Manufacturer: Wurth Elektronik; Rated Current: 3A; Gender: Male; Withstanding Voltage: 500VAC; Working Voltage: 250VAC; Pitch: 2.54mm; Contact Resistance: 20mOhm; Pin Number: 2; Mounting Technology: THT; Orientation: Vertical; Operating Temperature: -40to105degC; Packaging: Bag; Publisher: WurthElektronik; Datasheet URL: https://katalog.we-online.de/em/datasheet/6130xx11121.pdf; Manufacturer URL: http://www.we-online.de; Row Number: Single; Package Reference: 61300211121; Part Number: 61300211121
R9-R11 R22 R23 R25 = Res3: Resistor; Published: 8-Jun-2000; LatestRevisionDate: 29-May-2009; LatestRevisionNote: IPC-7351 Footprint Added.; PackageReference: J1-0603; Publisher: Altium Limited; PackageDescription: Chip Resistor
R24 = Res2: Resistor; Published: 8-Jun-2000; LatestRevisionDate: 17-Jul-2002; LatestRevisionNote: Re-released for DXP Platform.; PackageReference: AXIAL-0.4; Publisher: Altium Limited; PackageDescription: Axial Device, Thru-Hole; 2 Leads; 0.4 in Pin Spacing
SW6 SW11 SW12 = CMP-08827-000005-1: as SW5 on sheet Nordic; Digikey Description: SWITCH SLIDE DIP SPST 25MA 24V; ComponentLink2Description: Datasheet; Mount: Surface Mount; Manufacturer Part Number: A6S-1104-H; ComponentLink2URL: https://omronfs.omron.com/en_US/ecb/products/pdf/en-a6s.pdf; Category: Switch; Height: 3.95mm; Device Class L3: DIP Switches; Octopart: https://octopart.com/a6s-1104-h-omron-55410938; Mouser Description: DIP Switches / SIP Switches Dip Switch; Lead Free: Yes; Temperature Range Low: -20°C; Temperature Range High: +70°C; Automotive: No; Ambient Temperature Range Low: -20°C; Ambient Temperature Range High: +70°C; Voltage Rating Dc: 24V; Device Class L2: Switches; RoHS: TRUE; Package: 0; Contact Current Rating: 25mA; Device Class L1: Electromechanical; Temperature: -20°C to +70°C
U3 = TLV70237: Linear Regulator
U4 = TPS79333: Regulator
U5 = ADP1740ACPZ-1.8-R7: LDO Voltage Regulators 2A LDO Fix V-out Family; Manufacturer_Name: Analog Devices; Geometry.Height: 0.8mm; Mouser Part Number: 584-ADP1740ACPZ1.8R7; Mouser Price/Stock: https://www.mouser.co.uk/ProductDetail/Analog-Devices/ADP1740ACPZ-18-R7?qs=WIvQP4zGanhn2jVFfFpW%2Fg%3D%3D; Manufacturer_Part_Number: ADP1740ACPZ-1.8-R7; Datasheet Link: https://componentsearchengine.com/Datasheets/2/ADP1740ACPZ-1.8-R7.pdf
U9 U10 = TPS62361BYZHR: Integrated Circuit; Manufacturer_Name: Texas Instruments; Datasheet Link: http://www.ti.com/lit/gpn/tps62361b; Height: 0.625mm; Manufacturer_Part_Number: TPS62361BYZHR

## Sheet Shaheen.SchDoc
size A2
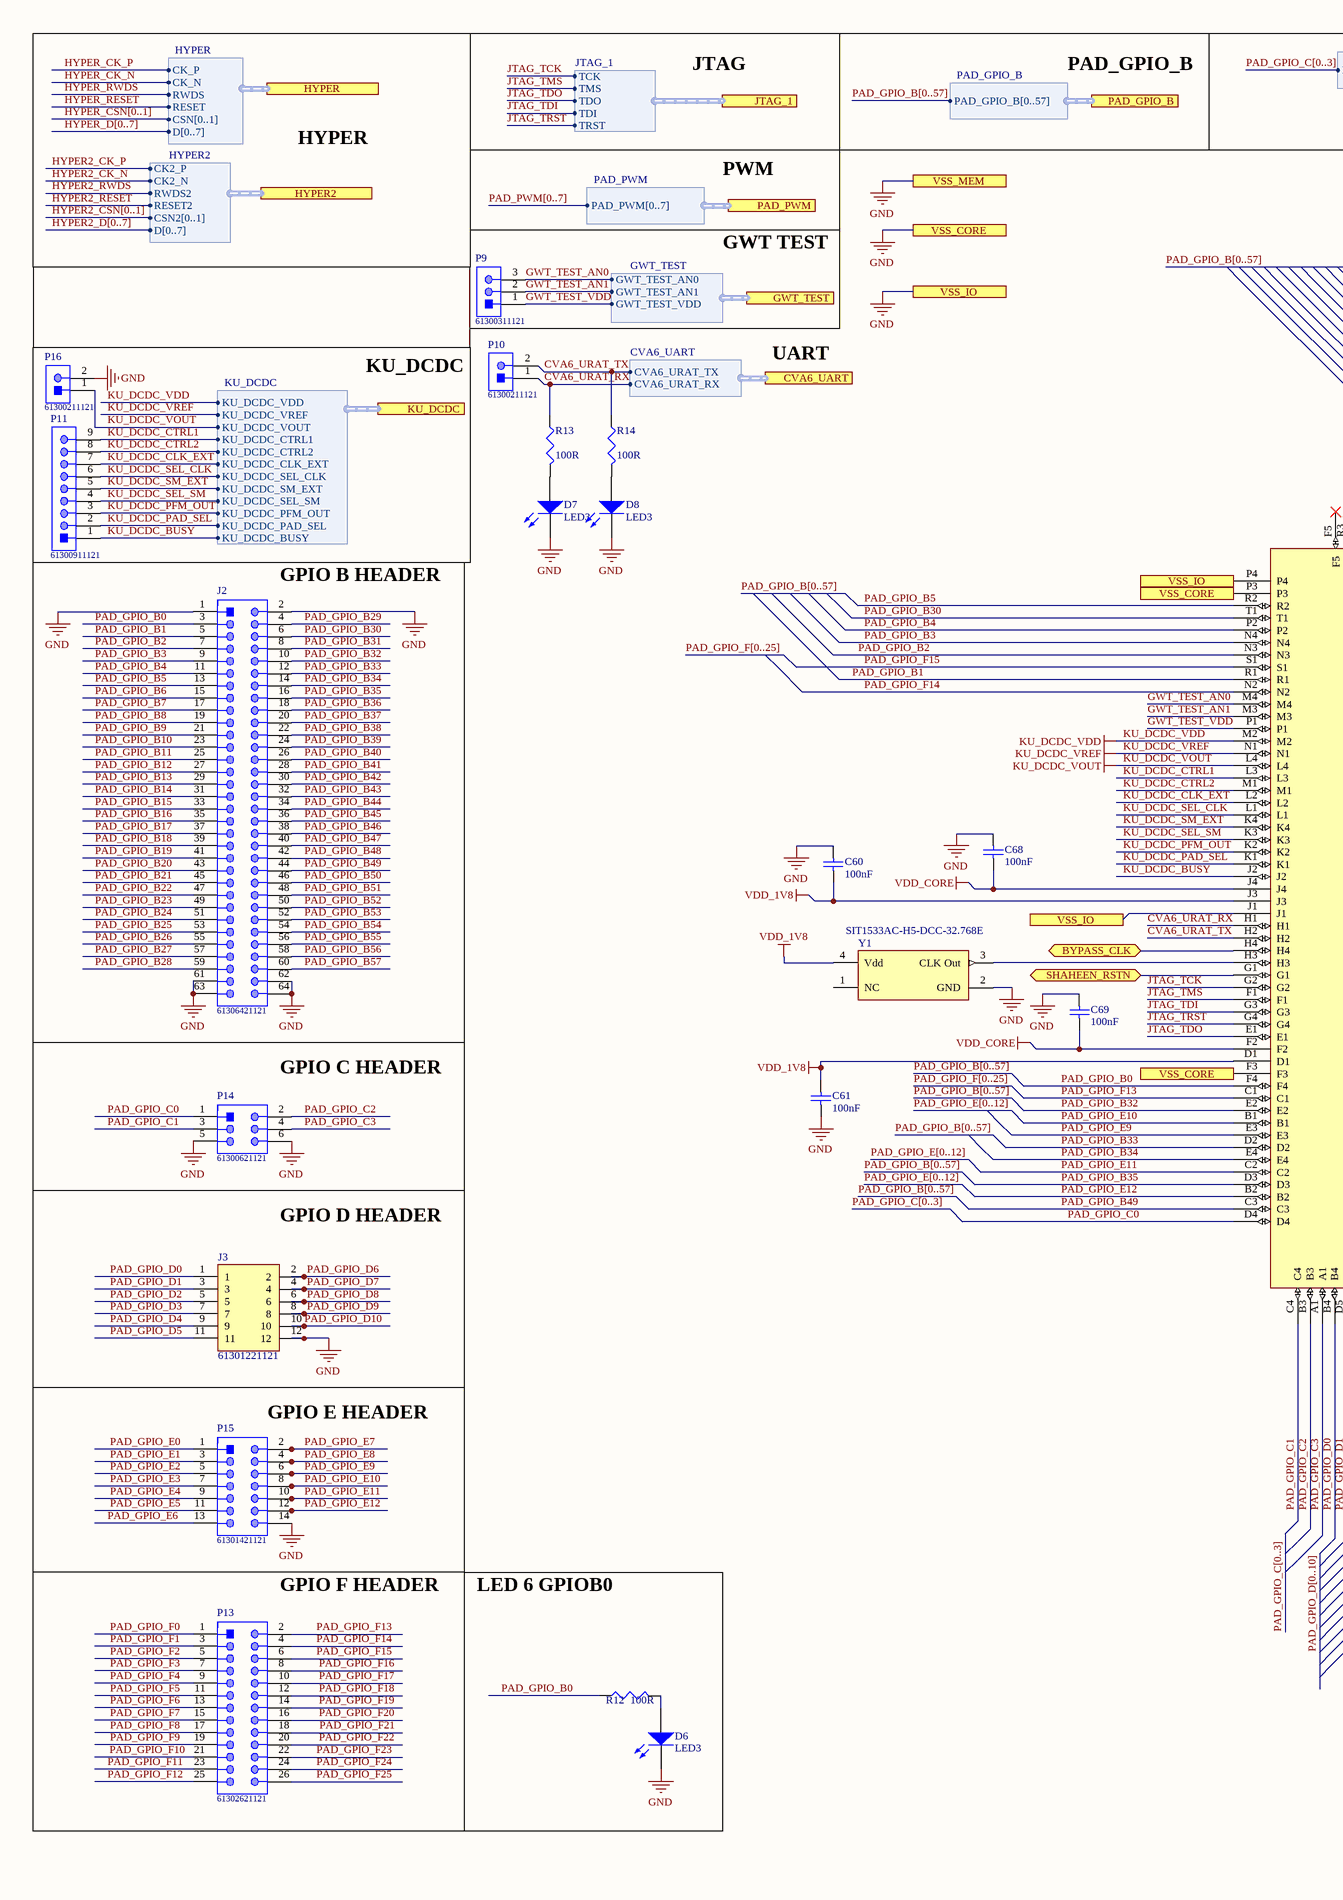
[diagram p4: Shaheen.SchDoc, left]
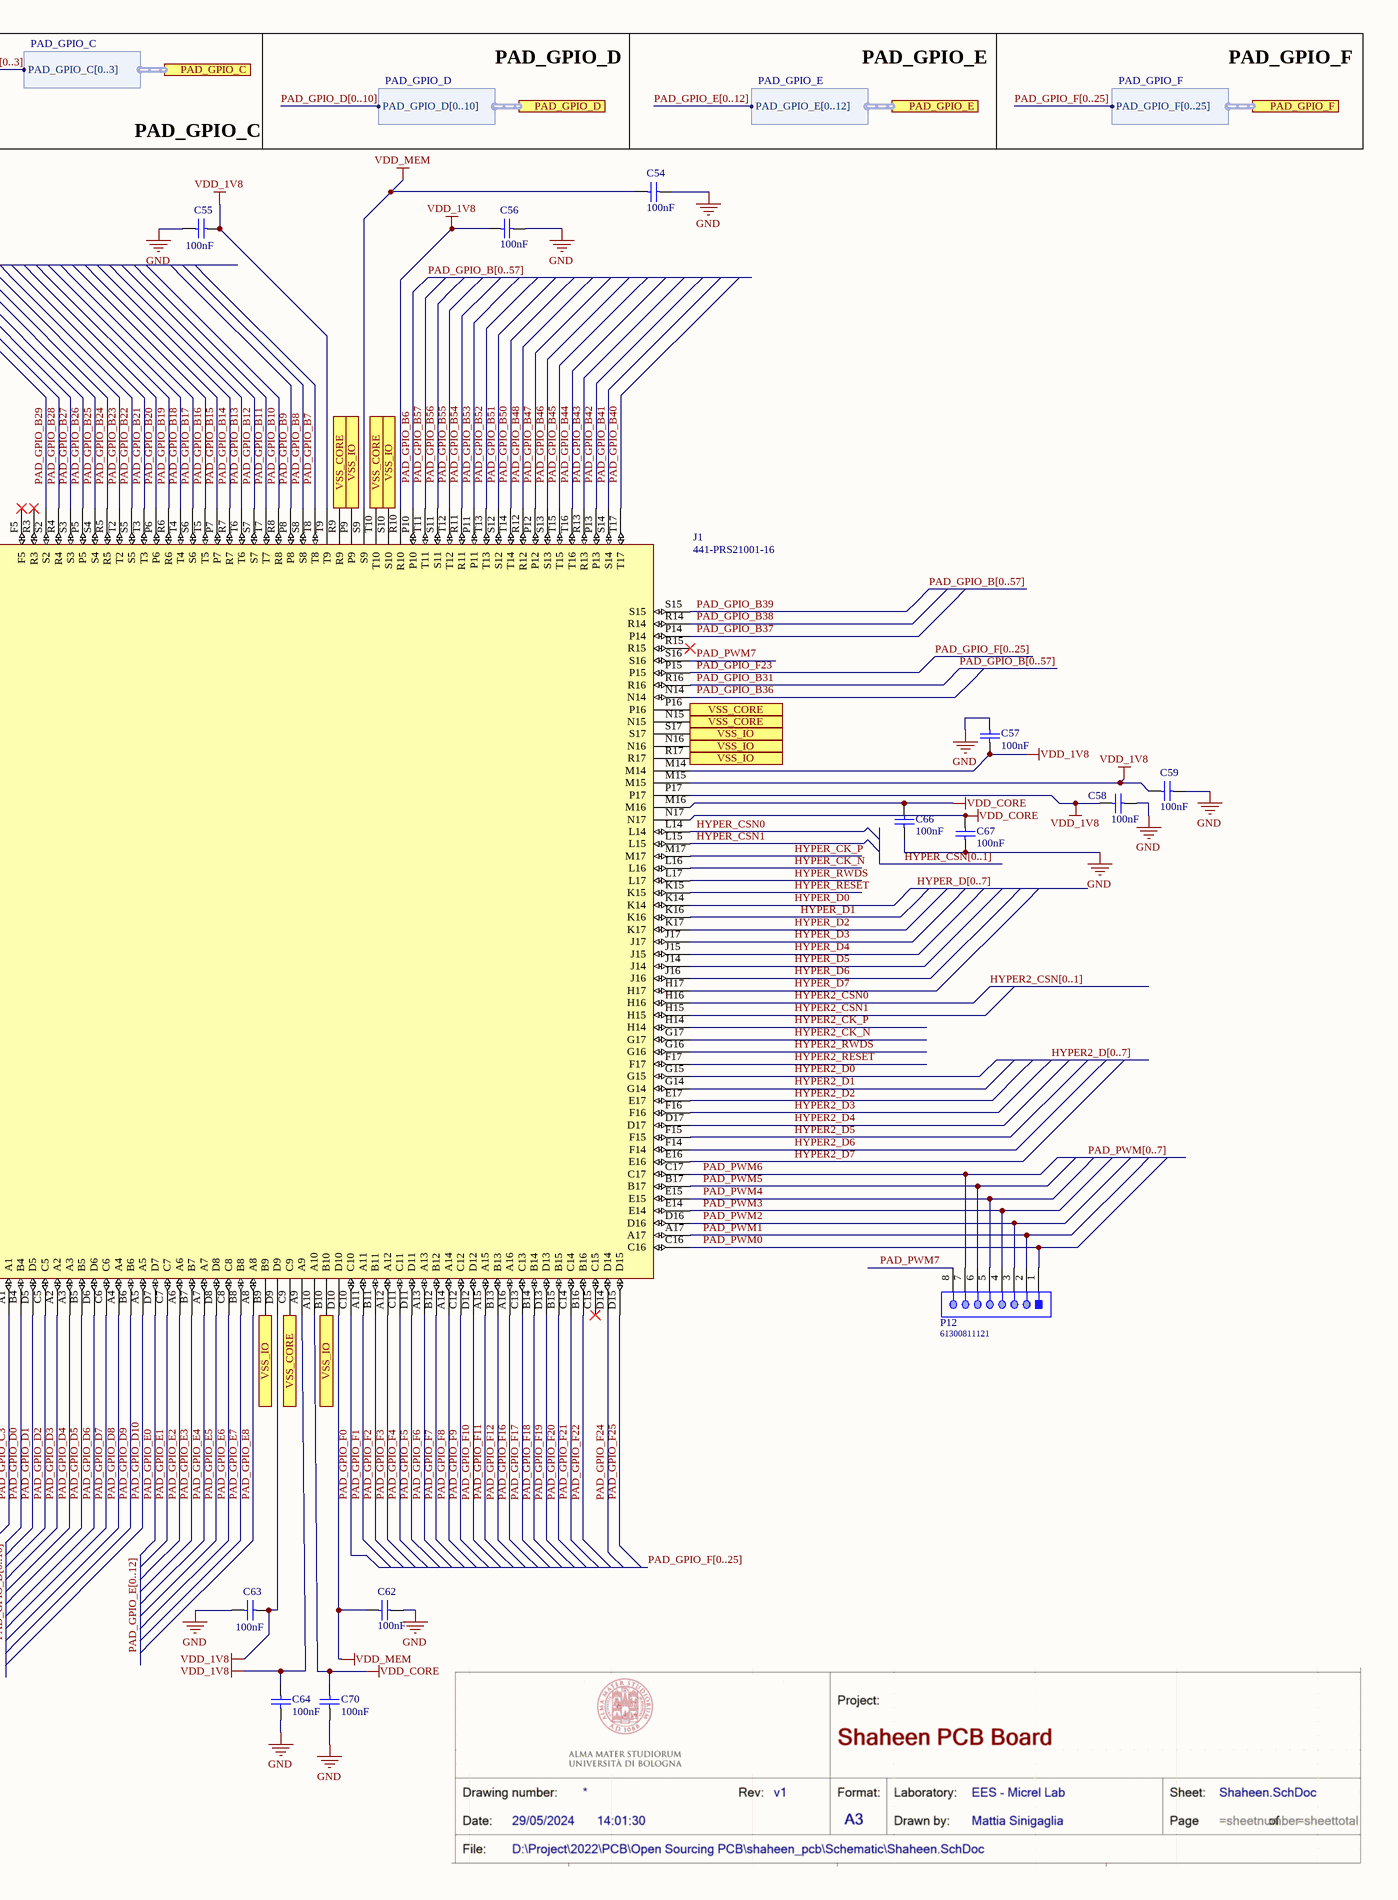
[diagram p5: Shaheen.SchDoc, right]

### Parts
C54  value 100nF  [0603]  (hidden comment: Cap)
C55  value 100nF  [0603]  (hidden comment: Cap)
C56  value 100nF  [0603]  (hidden comment: Cap)
C57  value 100nF  [0603]  (hidden comment: Cap)
C58  value 100nF  [0603]  (hidden comment: Cap)
C59  value 100nF  [0603]  (hidden comment: Cap)
C60  value 100nF  [0603]  (hidden comment: Cap)
C61  value 100nF  [0603]  (hidden comment: Cap)
C62  value 100nF  [0603]  (hidden comment: Cap)
C63  value 100nF  [0603]  (hidden comment: Cap)
C64  value 100nF  [0603]  (hidden comment: Cap)
C66  value 100nF  [0603]  (hidden comment: Cap)
C67  value 100nF  [0603]  (hidden comment: Cap)
C68  value 100nF  [0603]  (hidden comment: Cap)
C69  value 100nF  [0603]  (hidden comment: Cap)
C70  value 100nF  [0603]  (hidden comment: Cap)
D6  LED3  [0603]
D7  LED3  [0603]
D8  LED3  [0603]
J1  441-PRS21001-16  [441PRS2100116]
J2  61306421121  [61306421121]
J3  61301221121  [HDRV12W64P254_2X6_1524X508X889P]
P9  61300311121  [61300311121]
P10  61300211121  [61300211121]
P11  61300911121  [61300911121]
P12  61300811121  [61300811121]
P13  61302621121  [61302621121]
P14  61300621121  [61300621121]
P15  61301421121  [61301421121]
P16  61300211121  [61300211121]
R12  value 100R  [J1-0603]  (hidden comment: Res3)
R13  value 100R  [res_0402_R - modified]  (hidden comment: Res3)
R14  value 100R  [res_0402_R - modified]  (hidden comment: Res3)
Y1  SIT1533AC-H5-DCC-32.768E  [FP-SiT1533-H-MFG]

### Ports
BYPASS_CLK (bidir), CVA6_UART (harness CVA6_UART), GWT_TEST (harness GWT_TEST), HYPER2 (harness HYPER2), HYPER (harness HYPER), JTAG_1 (harness JTAG_1), KU_DCDC (harness KU_DCDC), PAD_GPIO_B (harness PAD_GPIO_B), PAD_GPIO_C (harness PAD_GPIO_C), PAD_GPIO_D (harness PAD_GPIO_D), PAD_GPIO_E (harness PAD_GPIO_E), PAD_GPIO_F (harness PAD_GPIO_F), PAD_PWM (harness PAD_PWM), SHAHEEN_RSTN (bidir), VSS_CORE, VSS_IO, VSS_MEM

### Harnesses
JTAG_1: TRST, TDI, TDO, TMS, TCK
HYPER2: D[0..7], CK2_P, CK2_N, RWDS2, CSN2[0..1], RESET2
HYPER: CK_N, CK_P, RWDS, CSN[0..1], D[0..7], RESET
CVA6_UART: CVA6_URAT_RX, CVA6_URAT_TX
PAD_GPIO_B: PAD_GPIO_B[0..57]
KU_DCDC: KU_DCDC_VDD, KU_DCDC_VREF, KU_DCDC_VOUT, KU_DCDC_CTRL1, KU_DCDC_CTRL2, KU_DCDC_CLK_EXT, KU_DCDC_SEL_CLK, KU_DCDC_SM_EXT, KU_DCDC_SEL_SM, KU_DCDC_PFM_OUT, KU_DCDC_PAD_SEL, KU_DCDC_BUSY
PAD_GPIO_C: PAD_GPIO_C[0..3]
PAD_GPIO_D: PAD_GPIO_D[0..10]
PAD_GPIO_E: PAD_GPIO_E[0..12]
PAD_GPIO_F: PAD_GPIO_F[0..25]
PAD_PWM: PAD_PWM[0..7]
GWT_TEST: GWT_TEST_VDD, GWT_TEST_AN1, GWT_TEST_AN0

### Nets
GND: C54.2 C55.2 C56.2 C57.2 C58.2 C59.1 C60.2 C61.2 C62.1 C63.2 C64.2 C66.1 C67.2 C68.2 C69.2 C70.2 D6.2(K) D7.2(K) D8.2(K) J1.B9 J1.B10 J1.C9 J1.F3 J1.J1 J1.N15 J1.N16 J1.P3 J1.P4 J1.P9 J1.P16 J1.R9 J1.R17 J1.S10 J1.S17 J1.T10 J2.1 J2.2 J2.61 J2.62 J2.63 J2.64 J3.12 P14.5 P14.6 P15.14 P16.2 Y1.2(GND) ; port VSS_MEM, port VSS_CORE, port VSS_IO
KU_DCDC_VDD: J1.M2 ; port KU_DCDC.KU_DCDC_VDD
KU_DCDC_VOUT: J1.L4 P16.1 ; port KU_DCDC.KU_DCDC_VOUT
KU_DCDC_VREF: J1.N1 ; port KU_DCDC.KU_DCDC_VREF
VDD_1V8: C55.1 C56.1 C57.1 C58.1 C59.2 C60.1 C61.1 C63.1 C64.1 J1.A9 J1.D1 J1.D9 J1.J3 J1.M14 J1.M15 J1.P17 J1.R10 J1.T9 Y1.4(Vdd)
VDD_CORE: C66.2 C67.1 C68.1 C69.1 C70.1 J1.A10 J1.F2 J1.J4 J1.M16 J1.N17
VDD_MEM: C54.1 C62.2 J1.D10 J1.S9
CVA6_URAT_RX: J1.H1 P10.1 R13.1 ; port CVA6_UART.CVA6_URAT_RX
CVA6_URAT_TX: J1.H2 P10.2 R14.1 ; port CVA6_UART.CVA6_URAT_TX
GWT_TEST_AN0: J1.M4 P9.3 ; port GWT_TEST.GWT_TEST_AN0
GWT_TEST_AN1: J1.M3 P9.2 ; port GWT_TEST.GWT_TEST_AN1
GWT_TEST_VDD: J1.P1 P9.1 ; port GWT_TEST.GWT_TEST_VDD
HYPER2_CK_N: J1.G17 ; port HYPER2.CK2_N
HYPER2_CK_P: J1.H14 ; port HYPER2.CK2_P
HYPER2_CSN0: J1.H16
HYPER2_CSN1: J1.H15
HYPER2_D0: J1.G15
HYPER2_D1: J1.G14
HYPER2_D2: J1.E17
HYPER2_D3: J1.F16
HYPER2_D4: J1.D17
HYPER2_D5: J1.F15
HYPER2_D6: J1.F14
HYPER2_D7: J1.E16
HYPER2_RESET: J1.F17 ; port HYPER2.RESET2
HYPER2_RWDS: J1.G16 ; port HYPER2.RWDS2
HYPER_CK_N: J1.L16 ; port HYPER.CK_N
HYPER_CK_P: J1.M17 ; port HYPER.CK_P
HYPER_CSN0: J1.L14
HYPER_CSN1: J1.L15
HYPER_D0: J1.K14
HYPER_D1: J1.K16
HYPER_D2: J1.K17
HYPER_D3: J1.J17
HYPER_D4: J1.J15
HYPER_D5: J1.J14
HYPER_D6: J1.J16
HYPER_D7: J1.H17
HYPER_RESET: J1.K15 ; port HYPER.RESET
HYPER_RWDS: J1.L17 ; port HYPER.RWDS
JTAG_TCK: J1.G2 ; port JTAG_1.TCK
JTAG_TDI: J1.G3 ; port JTAG_1.TDI
JTAG_TDO: J1.E1 ; port JTAG_1.TDO
JTAG_TMS: J1.F1 ; port JTAG_1.TMS
JTAG_TRST: J1.G4 ; port JTAG_1.TRST
KU_DCDC_BUSY: J1.J2 P11.1 ; port KU_DCDC.KU_DCDC_BUSY
KU_DCDC_CLK_EXT: J1.L2 P11.7 ; port KU_DCDC.KU_DCDC_CLK_EXT
KU_DCDC_CTRL1: J1.L3 P11.9 ; port KU_DCDC.KU_DCDC_CTRL1
KU_DCDC_CTRL2: J1.M1 P11.8 ; port KU_DCDC.KU_DCDC_CTRL2
KU_DCDC_PAD_SEL: J1.K1 P11.2 ; port KU_DCDC.KU_DCDC_PAD_SEL
KU_DCDC_PFM_OUT: J1.K2 P11.3 ; port KU_DCDC.KU_DCDC_PFM_OUT
KU_DCDC_SEL_CLK: J1.L1 P11.6 ; port KU_DCDC.KU_DCDC_SEL_CLK
KU_DCDC_SEL_SM: J1.K3 P11.4 ; port KU_DCDC.KU_DCDC_SEL_SM
KU_DCDC_SM_EXT: J1.K4 P11.5 ; port KU_DCDC.KU_DCDC_SM_EXT
PAD_GPIO_B0: J1.F4 J2.3 R12.1
PAD_GPIO_B1: J1.R1 J2.5
PAD_GPIO_B2: J1.N3 J2.7
PAD_GPIO_B3: J1.N4 J2.9
PAD_GPIO_B4: J1.P2 J2.11
PAD_GPIO_B5: J1.R2 J2.13
PAD_GPIO_B6: J1.P10 J2.15
PAD_GPIO_B7: J1.T8 J2.17
PAD_GPIO_B8: J1.S8 J2.19
PAD_GPIO_B9: J1.P8 J2.21
PAD_GPIO_B10: J1.R8 J2.23
PAD_GPIO_B11: J1.T7 J2.25
PAD_GPIO_B12: J1.S7 J2.27
PAD_GPIO_B13: J1.T6 J2.29
PAD_GPIO_B14: J1.R7 J2.31
PAD_GPIO_B15: J1.P7 J2.33
PAD_GPIO_B16: J1.T5 J2.35
PAD_GPIO_B17: J1.S6 J2.37
PAD_GPIO_B18: J1.T4 J2.39
PAD_GPIO_B19: J1.R6 J2.41
PAD_GPIO_B20: J1.P6 J2.43
PAD_GPIO_B21: J1.T3 J2.45
PAD_GPIO_B22: J1.S5 J2.47
PAD_GPIO_B23: J1.T2 J2.49
PAD_GPIO_B24: J1.R5 J2.51
PAD_GPIO_B25: J1.S4 J2.53
PAD_GPIO_B26: J1.P5 J2.55
PAD_GPIO_B27: J1.S3 J2.57
PAD_GPIO_B28: J1.R4 J2.59
PAD_GPIO_B29: J1.S2 J2.4
PAD_GPIO_B30: J1.T1 J2.6
PAD_GPIO_B31: J1.R16 J2.8
PAD_GPIO_B32: J1.E2 J2.10
PAD_GPIO_B33: J1.D2 J2.12
PAD_GPIO_B34: J1.E4 J2.14
PAD_GPIO_B35: J1.D3 J2.16
PAD_GPIO_B36: J1.N14 J2.18
PAD_GPIO_B37: J1.P14 J2.20
PAD_GPIO_B38: J1.R14 J2.22
PAD_GPIO_B39: J1.S15 J2.24
PAD_GPIO_B40: J1.T17 J2.26
PAD_GPIO_B41: J1.S14 J2.28
PAD_GPIO_B42: J1.P13 J2.30
PAD_GPIO_B43: J1.R13 J2.32
PAD_GPIO_B44: J1.T16 J2.34
PAD_GPIO_B45: J1.T15 J2.36
PAD_GPIO_B46: J1.S13 J2.38
PAD_GPIO_B47: J1.P12 J2.40
PAD_GPIO_B48: J1.R12 J2.42
PAD_GPIO_B49: J1.C3 J2.44
PAD_GPIO_B50: J1.T14 J2.46
PAD_GPIO_B51: J1.S12 J2.48
PAD_GPIO_B52: J1.T13 J2.50
PAD_GPIO_B53: J1.P11 J2.52
PAD_GPIO_B54: J1.R11 J2.54
PAD_GPIO_B55: J1.T12 J2.56
PAD_GPIO_B56: J1.S11 J2.58
PAD_GPIO_B57: J1.T11 J2.60
PAD_GPIO_C0: J1.D4 P14.1
PAD_GPIO_C1: J1.C4 P14.3
PAD_GPIO_C2: J1.B3 P14.2
PAD_GPIO_C3: J1.A1 P14.4
PAD_GPIO_D0: J1.B4 J3.1
PAD_GPIO_D1: J1.D5 J3.3
PAD_GPIO_D2: J1.C5 J3.5
PAD_GPIO_D3: J1.A2 J3.7
PAD_GPIO_D4: J1.A3 J3.9
PAD_GPIO_D5: J1.B5 J3.11
PAD_GPIO_D6: J1.D6 J3.2
PAD_GPIO_D7: J1.C6 J3.4
PAD_GPIO_D8: J1.A4 J3.6
PAD_GPIO_D9: J1.B6 J3.8
PAD_GPIO_D10: J1.A5 J3.10
PAD_GPIO_E0: J1.D7 P15.1
PAD_GPIO_E1: J1.C7 P15.3
PAD_GPIO_E2: J1.A6 P15.5
PAD_GPIO_E3: J1.B7 P15.7
PAD_GPIO_E4: J1.A7 P15.9
PAD_GPIO_E5: J1.D8 P15.11
PAD_GPIO_E6: J1.C8 P15.13
PAD_GPIO_E7: J1.B8 P15.2
PAD_GPIO_E8: J1.A8 P15.4
PAD_GPIO_E9: J1.E3 P15.6
PAD_GPIO_E10: J1.B1 P15.8
PAD_GPIO_E11: J1.C2 P15.10
PAD_GPIO_E12: J1.B2 P15.12
PAD_GPIO_F0: J1.C10 P13.1
PAD_GPIO_F1: J1.A11 P13.3
PAD_GPIO_F2: J1.B11 P13.5
PAD_GPIO_F3: J1.A12 P13.7
PAD_GPIO_F4: J1.C11 P13.9
PAD_GPIO_F5: J1.D11 P13.11
PAD_GPIO_F6: J1.A13 P13.13
PAD_GPIO_F7: J1.B12 P13.15
PAD_GPIO_F8: J1.A14 P13.17
PAD_GPIO_F9: J1.C12 P13.19
PAD_GPIO_F10: J1.D12 P13.21
PAD_GPIO_F11: J1.A15 P13.23
PAD_GPIO_F12: J1.B13 P13.25
PAD_GPIO_F13: J1.C1 P13.2
PAD_GPIO_F14: J1.N2 P13.4
PAD_GPIO_F15: J1.S1 P13.6
PAD_GPIO_F16: J1.A16 P13.8
PAD_GPIO_F17: J1.C13 P13.10
PAD_GPIO_F18: J1.B14 P13.12
PAD_GPIO_F19: J1.D13 P13.14
PAD_GPIO_F20: J1.B15 P13.16
PAD_GPIO_F21: J1.C14 P13.18
PAD_GPIO_F22: J1.B16 P13.20
PAD_GPIO_F23: J1.P15 P13.22
PAD_GPIO_F24: J1.D14 P13.24
PAD_GPIO_F25: J1.D15 P13.26
PAD_PWM0: J1.C16 P12.1
PAD_PWM1: J1.A17 P12.2
PAD_PWM2: J1.D16 P12.3
PAD_PWM3: J1.E14 P12.4
PAD_PWM4: J1.E15 P12.5
PAD_PWM5: J1.B17 P12.6
PAD_PWM6: J1.C17 P12.7
PAD_PWM7: J1.S16 P12.8
NetD6_1: D6.1(A) R12.2
NetD7_1: D7.1(A) R13.2
NetD8_1: D8.1(A) R14.2
NetJ1_G1: J1.G1 ; port SHAHEEN_RSTN
NetJ1_H3: J1.H3 Y1.3(CLK_Out)
NetJ1_H4: J1.H4 ; port BYPASS_CLK

Not connected (* = marked no-connect by the designer): J1 C15* F5* R3* R15*; Y1 1(NC)

### Buses and harness runs
bus HYPER2_CSN[0..1]
bus HYPER2_D[0..7]
bus HYPER_CSN[0..1]
bus HYPER_D[0..7]
bus PAD_GPIO_B[0..57]
bus PAD_GPIO_C[0..3]
bus PAD_GPIO_D[0..10]
bus PAD_GPIO_E[0..12]
bus PAD_GPIO_F[0..25]
bus PAD_PWM[0..7]

### Notes on the sheet
- JTAG
- PAD_GPIO_B
- PAD_GPIO_D
- PAD_GPIO_E
- PAD_GPIO_F
- HYPER
- PAD_GPIO_C
- PWM
- GWT TEST
- KU_DCDC
- UART
- (near J2) GPIO B HEADER
- (near P14) GPIO C HEADER
- GPIO D HEADER
- (near P15) GPIO E HEADER
- GPIO F HEADER
- LED 6 GPIOB0

### Library data of the parts
C54-C64 C66-C70 = Cap: Capacitor; Published: 8-Jun-2000; LatestRevisionDate: 17-Jul-2002; LatestRevisionNote: Re-released for DXP Platform.; PackageReference: RAD-0.3; Publisher: Altium Limited; PackageDescription: Radial Cap, Thru-Hole; 2 Leads; 0.3 in Pin Spacing
D6-D8 = LED3: Typical BLUE SiC LED; Published: 8-Jun-2000; LatestRevisionDate: 17-Dec-2003; LatestRevisionNote: PCB Footprint replaced.; DatasheetVersion: 16-Apr-2002; PackageVersion: 16-Apr-2002; PackageReference: 3.5X2.8X1.9; Publisher: Altium Limited; PackageDescription: SM LED; 2 C-Bend Leads; Body 3.5 x 2.8 x 1.9 mm, inc leads (LxWxH typ)
J1 = 441-PRS21001-16: Connector; Manufacturer_Name: ARIES; Datasheet Link: https://www.mouser.it/datasheet/2/35/10004_pga_zif_test_and_burn_in_socket-1225760.pdf; Height: 10.92mm; Manufacturer_Part_Number: 441-PRS21001-16; Mouser Part Number: 535-441-PRS21001-16; Mouser Price/Stock: https://www.mouser.co.uk/ProductDetail/Aries-Electronics/441-PRS21001-16?qs=qSpSzuzdqG3uVfRDOHdDNQ%3D%3D
J2 = CMP-1502-01138-1: THT Vertical Pin Header WR-PHD, Pitch 2.54 mm, Dual Row, 64 pins; Manufacturer: Wurth Elektronik; Withstanding Voltage: 500VAC; Rated Current: 3A; Gender: Male; Pin Number: 64; Working Voltage: 250VAC; Contact Resistance: 20mOhm; Pitch: 2.54mm; Orientation: Vertical; Manufacturer URL: http://www.we-online.de; Package Reference: 61306421121; Operating Temperature: -40to105degC; Part Number: 61306421121; Row Number: Dual; Datasheet URL: https://katalog.we-online.de/em/datasheet/6130xx21121.pdf; Mounting Technology: THT; Publisher: WurthElektronik; Packaging: Bag
J3 = 61301221121: Connector; Manufacturer_Name: Wurth Elektronik; Datasheet Link: https://componentsearchengine.com//61301221121.pdf; Height: 8.89mm; Mouser2 Part Number: 710-61301221121; Mouser2 Price/Stock: https://www.mouser.com/Search/Refine.aspx?Keyword=710-61301221121; Manufacturer_Part_Number: 61301221121
P9 = CMP-1502-01062-1: THT Vertical Pin Header WR-PHD, Pitch 2.54 mm, Single Row, 3 pins; Manufacturer: Wurth Elektronik; Withstanding Voltage: 500VAC; Working Voltage: 250VAC; Rated Current: 3A; Pitch: 2.54mm; Pin Number: 3; Gender: Male; Contact Resistance: 20mOhm; Package Reference: 61300311121; Manufacturer URL: http://www.we-online.de; Datasheet URL: https://katalog.we-online.de/em/datasheet/6130xx11121.pdf; Operating Temperature: -40to105degC; Part Number: 61300311121; Orientation: Vertical; Packaging: Bag; Row Number: Single; Mounting Technology: THT; Publisher: WurthElektronik
P10 P16 = CMP-1712-00002-4: as P1 on sheet PowerDomain; Mounting Technology: THT; Orientation: Vertical; Operating Temperature: -40to105degC; Packaging: Bag; Publisher: WurthElektronik; Datasheet URL: https://katalog.we-online.de/em/datasheet/6130xx11121.pdf; Manufacturer URL: http://www.we-online.de; Row Number: Single; Package Reference: 61300211121; Part Number: 61300211121
P11 = CMP-1502-01080-1: THT Vertical Pin Header WR-PHD, Pitch 2.54 mm, Single Row, 9 pins; Manufacturer: Wurth Elektronik; Pitch: 2.54mm; Gender: Male; Working Voltage: 250VAC; Contact Resistance: 20mOhm; Withstanding Voltage: 500VAC; Pin Number: 9; Rated Current: 3A; Package Reference: 61300911121; Part Number: 61300911121; Mounting Technology: THT; Publisher: WurthElektronik; Manufacturer URL: http://www.we-online.de; Orientation: Vertical; Datasheet URL: https://katalog.we-online.de/em/datasheet/6130xx11121.pdf; Operating Temperature: -40to105degC; Row Number: Single; Packaging: Bag
P12 = CMP-1502-01076-1: THT Vertical Pin Header WR-PHD, Pitch 2.54 mm, Single Row, 8 pins; Manufacturer: Wurth Elektronik; Rated Current: 3A; Pin Number: 8; Working Voltage: 250VAC; Gender: Male; Contact Resistance: 20mOhm; Pitch: 2.54mm; Withstanding Voltage: 500VAC; Publisher: WurthElektronik; Operating Temperature: -40to105degC; Orientation: Vertical; Row Number: Single; Part Number: 61300811121; Package Reference: 61300811121; Mounting Technology: THT; Packaging: Bag; Manufacturer URL: http://www.we-online.de; Datasheet URL: https://katalog.we-online.de/em/datasheet/6130xx11121.pdf
P13 = CMP-1502-01114-1: THT Vertical Pin Header WR-PHD, Pitch 2.54 mm, Dual Row, 26 pins; Manufacturer: Wurth Elektronik; Pin Number: 26; Withstanding Voltage: 500VAC; Working Voltage: 250VAC; Contact Resistance: 20mOhm; Pitch: 2.54mm; Rated Current: 3A; Gender: Male; Package Reference: 61302621121; Manufacturer URL: http://www.we-online.de; Row Number: Dual; Packaging: Bag; Publisher: WurthElektronik; Datasheet URL: https://katalog.we-online.de/em/datasheet/6130xx21121.pdf; Operating Temperature: -40to105degC; Mounting Technology: THT; Orientation: Vertical; Part Number: 61302621121
P14 = CMP-1502-01072-1: THT Vertical Pin Header WR-PHD, Pitch 2.54 mm, Dual Row, 6 pins; Manufacturer: Wurth Elektronik; Contact Resistance: 20mOhm; Withstanding Voltage: 500VAC; Pin Number: 6; Gender: Male; Pitch: 2.54mm; Working Voltage: 250VAC; Rated Current: 3A; Packaging: Bag; Row Number: Dual; Manufacturer URL: http://www.we-online.de; Part Number: 61300621121; Operating Temperature: -40to105degC; Mounting Technology: THT; Package Reference: 61300621121; Datasheet URL: https://katalog.we-online.de/em/datasheet/6130xx21121.pdf; Orientation: Vertical; Publisher: WurthElektronik
P15 = CMP-1502-01093-1: THT Vertical Pin Header WR-PHD, Pitch 2.54 mm, Dual Row, 14 pins; Manufacturer: Wurth Elektronik; Rated Current: 3A; Withstanding Voltage: 500VAC; Gender: Male; Pin Number: 14; Pitch: 2.54mm; Working Voltage: 250VAC; Contact Resistance: 20mOhm; Mounting Technology: THT; Orientation: Vertical; Packaging: Bag; Part Number: 61301421121; Manufacturer URL: http://www.we-online.de; Datasheet URL: https://katalog.we-online.de/em/datasheet/6130xx21121.pdf; Operating Temperature: -40to105degC; Package Reference: 61301421121; Publisher: WurthElektronik; Row Number: Dual
R12-R14 = Res3: Resistor; Published: 8-Jun-2000; LatestRevisionDate: 29-May-2009; LatestRevisionNote: IPC-7351 Footprint Added.; PackageReference: J1-0603; Publisher: Altium Limited; PackageDescription: Chip Resistor
Y1 = CMP-25159-260609-1: MEMS OSC XO 32.7680KHZ LVCMOS; Frequency Stability: 75ppm; Max Supply Current: 1.3uA; Frequency: 32.768kHz; Min Operating Temperature: -10°C; Series: SiT1533; Height: 0.024inch; Packaging: Cut Tape; Case/Package: SMD/SMT; Max Operating Temperature: 70°C; RoHS Compliant: Yes; Length: 0.079inch; Width: 0.047inch; Mount: Surface Mount; Number of Pins: 4